# Altium project PCB_Control.V03.R00.PrjPcb (part 2 of 3)

## Sheet Amplificador.V03.R00.SchDoc: Etapa de Amplificación
size A4; SheetNumber: 8; SheetTotal: 18
Used 2 times, as channels DDS_CANAL1/Amplificador, DDS_CANAL2/Amplificador. Parts and nets are listed once, with the designators drawn on the sheet.
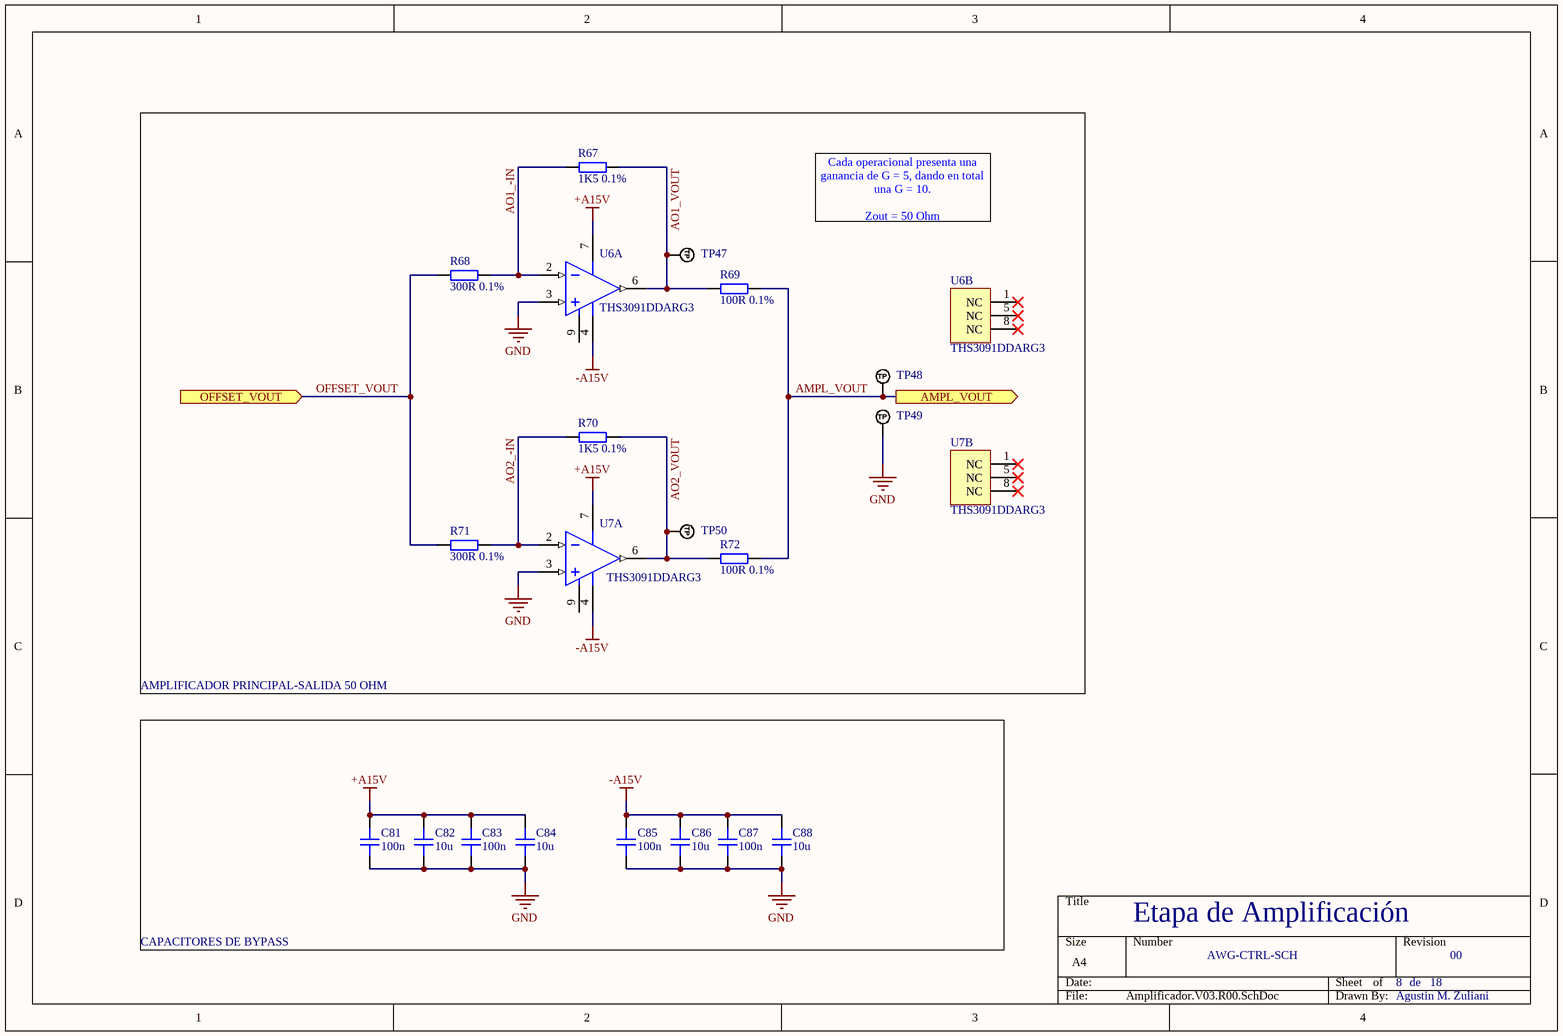
[diagram p8: Amplificador.V03.R00.SchDoc]

### Parts
C81  100n  [CAP_0805]
C82  10u  [CAP_0805]
C83  100n  [CAP_0805]
C84  10u  [CAP_0805]
C85  100n  [CAP_0805]
C86  10u  [CAP_0805]
C87  100n  [CAP_0805]
C88  10u  [CAP_0805]
R67  1K5 0.1%  [RES_0805]
R68  300R 0.1%  [RES_0805]
R69  100R 0.1%  [RES_0805]
R70  1K5 0.1%  [RES_0805]
R71  300R 0.1%  [RES_0805]
R72  100R 0.1%  [RES_0805]
TP47  TP_NOBOM  [PAD_RND_1MM]  (value not drawn)  (no BOM)
TP48  TP_NOBOM  [PAD_RND_1MM]  (value not drawn)  (no BOM)
TP49  TP_NOBOM  [PAD_RND_1MM]  (value not drawn)  (no BOM)
TP50  TP_NOBOM  [PAD_RND_1MM]  (value not drawn)  (no BOM)
U6  THS3091DDARG3  [TI-DDA8-1775X1775TP_M]  (parts A,B of 2)
U7  THS3091DDARG3  [TI-DDA8-1775X1775TP_M]  (parts A,B of 2)

### Blocks framed on the sheet
AMPLIFICADOR PRINCIPAL-SALIDA 50 OHM: R67-R72 TP47-TP50 U6 U7
CAPACITORES DE BYPASS: C81-C88

### Ports
AMPL_VOUT (out), OFFSET_VOUT (in)

### Nets
+A15V: C81.1 C82.1 C83.1 C84.1 U6.7(VS+) U7.7(VS+)
-A15V: C85.1 C86.1 C87.1 C88.1 U6.4(VS-) U7.4(VS-)
GND: C81.2 C82.2 C83.2 C84.2 C85.2 C86.2 C87.2 C88.2 TP49.1(TP) U6.3(VIN+) U7.3(VIN+)
AMPL_VOUT: R69.2 R72.2 TP48.1(TP) ; port AMPL_VOUT
AO1_-IN: R67.1 R68.2 U6.2(VIN-)
AO1_VOUT: R67.2 R69.1 TP47.1(TP) U6.6(VOUT)
AO2_-IN: R70.1 R71.2 U7.2(VIN-)
AO2_VOUT: R70.2 R72.1 TP50.1(TP) U7.6(VOUT)
OFFSET_VOUT: R68.1 R71.1 ; port OFFSET_VOUT

Not connected (* = marked no-connect by the designer): U6 1(NC)* 5(NC)* 8(NC)* 9(EP); U7 1(NC)* 5(NC)* 8(NC)* 9(EP)

### Channels
DDS_CANAL1/Amplificador: designators C81=C28 C82=C29 C83=C30 C84=C31 C85=C32 C86=C33 C87=C34 C88=C35 R67=R6#2 R68=R7#2 R69=R8#2 R70=R9#2 R71=R10#2 R72=R11#2 TP47=TP14#2 TP48=TP15#2 TP49=TP16#2 TP50=TP17#2 U6=U1#2 U7=U2#2; ports AMPL_VOUT=AMPL_VOUT OFFSET_VOUT=OFFSET_VOUT
DDS_CANAL2/Amplificador: designators C81=C36 C82=C37 C83=C38 C84=C39 C85=C40 C86=C41 C87=C42 C88=C43 R67=R12#2 R68=R13#2 R69=R14#2 R70=R15#2 R71=R16#2 R72=R17#2 TP47=TP18#2 TP48=TP19#2 TP49=TP20#2 TP50=TP21#2 U6=U3#2 U7=U4#2; ports AMPL_VOUT=AMPL_VOUT OFFSET_VOUT=OFFSET_VOUT

### Notes on the sheet
- Cada operacional presenta una ganancia de G = 5, dando en total una G = 10.
  Zout = 50 Ohm
- de

### Library data of the parts
C81-C88 = CAP_0805: Capacitor SMD 0805; Manufacturer: *; Manufacturer Part Number: *; Distributor Link: *; LCSC: *; Rating: *; Dielectric: *
R67-R72 = RES_0805: Resistor SMD 0805; Manufacturer: *; Manufacturer Part Number: *; Distributor Link: *; LCSC: *
TP47-TP50 = TEST_POINT_RND_1MM: Test Point Round 1mm (NO BOM)
U6 U7 = CMP-0018-00513-2: Single-High-Voltage, Low Distortion, Current-Feedback Operational Amplifier, 10 to 30 V, -40 to 85 degC, 8-pin SOP (DDA8), Green (RoHS & no Sb/Br); Manufacturer: Texas Instruments; Vn at Flatband(Typ)(nV/rtHz): 2; Vio(Max)(mV): 4; BW @ Acl(MHz): 235; 3rd Harmonic(dBc): 74; Iib(Max)(nA): 20000; Io(Typ)(mA): 250; Slew Rate(Typ)(V/us): 7300; @ MHz: 10; THD (Fc is 1 MHz)(Typ)(dB): -75; Diff Gain(%): 0.013; Vs(Max)(V): 30; Sub Family: High Output Current Amplifier (>=50mA), High Speed Amplifier (>=50MHz), High Supply Voltage Amplifier (>=30V); 2nd Harmonic(dBc): 66; Iq per channel(Max)(mA): 11; Diff Phase(deg): 0.02; Number of Channels: 1; Settling Time (0.1%)(Typ)(ns): 42; PartNumber: THS3091DDARG3; DatasheetVersion: SLOS423G; ComponentLink1Description: Manufacturer URL; Vs(Min)(V): 10; Code_JEDEC: MS-012; ComponentLink3Description: Package Specification; ComponentLink2Description: Datasheet; PackageReference: DDA8-1775X1775TP; ComponentLink1URL: http://www.ti.com/; PackageVersion: 4202561/F, 12/2011; PackageDescription: 8-Pin PowerPAD(TM) Plastic Small Outline, Body 4.9 x 3.9 mm, Pitch 1.27 mm; Mounting Technology: Surface Mount; ComponentLink3URL: http://www.ti.com/litv/pdf/mpds092e; Eco-Plan: Green (RoHS & no Sb/Br); Acl, min stable gain(V/V): 1; ComponentLink2URL: http://www.ti.com/general/docs/lit/getliterature.tsp?genericPartNumber=THS3091&fileType=pdf

## Sheet SY55857L.V03.R00.SchDoc: Conversor de CMOS a LVPECL
size A4; SheetNumber: 10; SheetTotal: 18
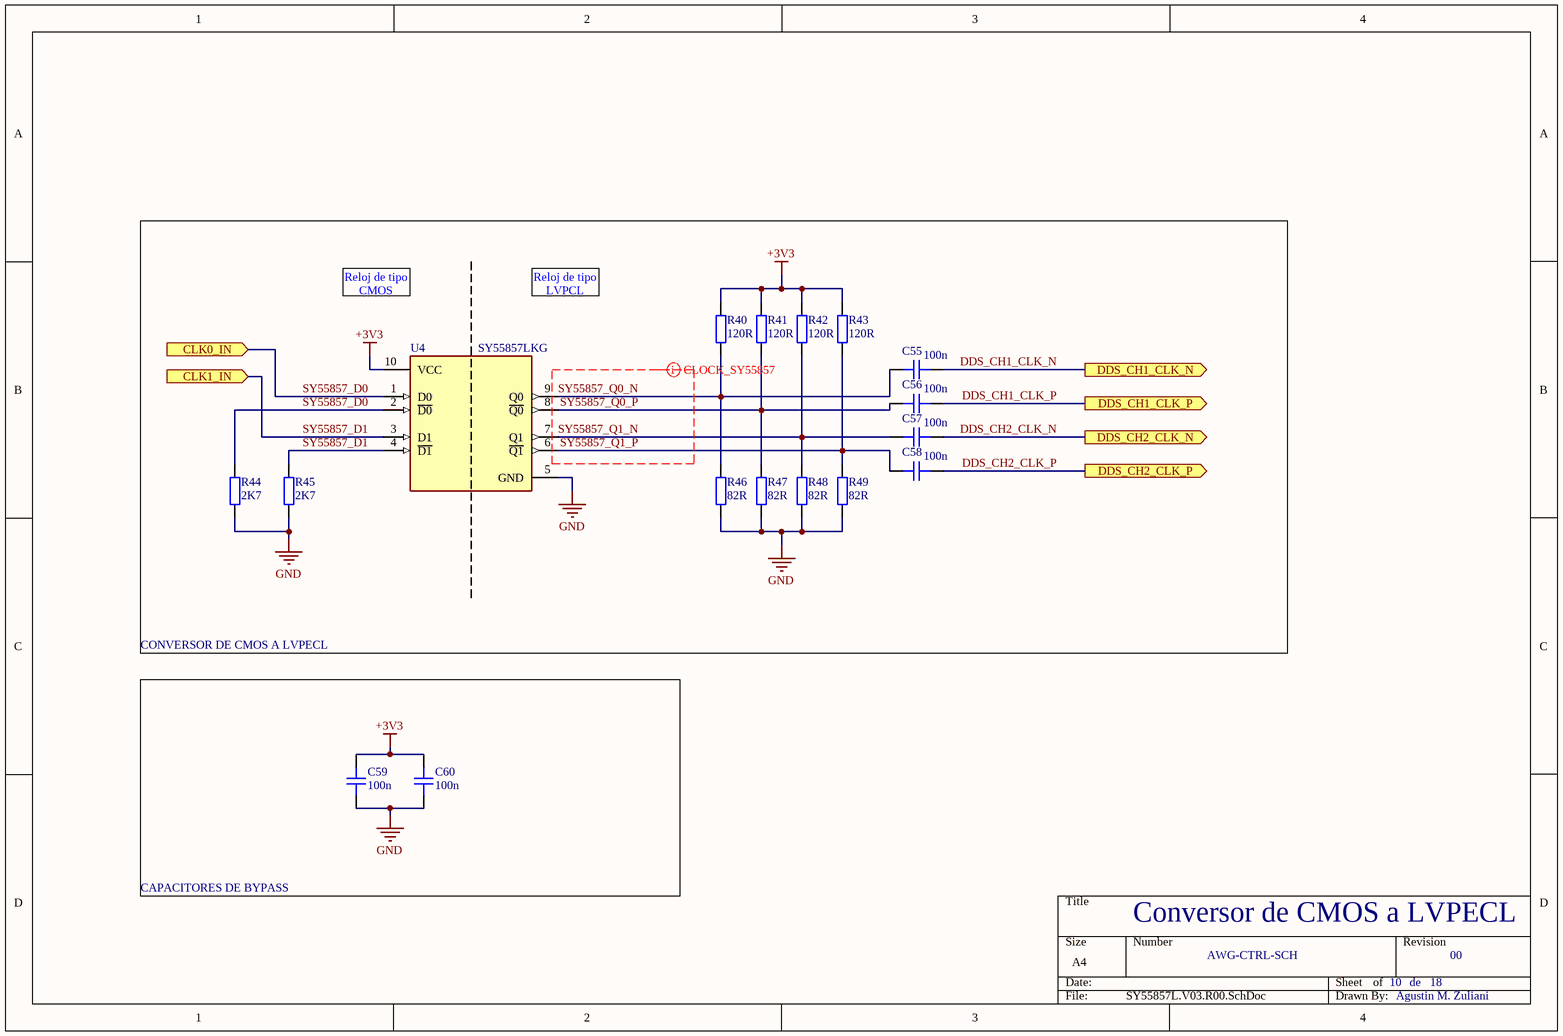
[diagram p9: SY55857L.V03.R00.SchDoc]

### Parts
(Parts that share a designator on the sheet are numbered #1, #2 ... from top to bottom, then left to right.)
C55#2  100n  [CAP_0805]
C56#1  100n  [CAP_0805]
C57#1  100n  [CAP_0805]
C58#1  100n  [CAP_0805]
C59#1  100n  [CAP_0805]
C60#1  100n  [CAP_0805]
R40  120R  [RES_0805]
R41  120R  [RES_0805]
R42  120R  [RES_0805]
R43  120R  [RES_0805]
R44  2K7  [RES_0805]
R45  2K7  [RES_0805]
R46  82R  [RES_0805]
R47  82R  [RES_0805]
R48  82R  [RES_0805]
R49  82R  [RES_0805]
U4#1  SY55857LKG  [FP-K10-1-IPC_A]

### Blocks framed on the sheet
CONVERSOR DE CMOS A LVPECL: C55#2 C56#1 C57#1 C58#1 R40-R49 U4#1
CAPACITORES DE BYPASS: C59#1 C60#1

### Ports
CLK0_IN (in), CLK1_IN (in), DDS_CH1_CLK_N (out), DDS_CH1_CLK_P (out), DDS_CH2_CLK_N (out), DDS_CH2_CLK_P (out)

### Nets
+3V3: C59#1.2 C60#1.2 R40.2 R41.2 R42.2 R43.2 U4#1.10(VCC)
GND: C59#1.1 C60#1.1 R44.2 R45.2 R46.1 R47.1 R48.1 R49.1 U4#1.5(GND)
DDS_CH1_CLK_N: C55#2.1 ; port DDS_CH1_CLK_N  [project net AD9102_CLK_N]
DDS_CH1_CLK_P: C56#1.1 ; port DDS_CH1_CLK_P  [project net AD9102_CLK_P]
DDS_CH2_CLK_N: C57#1.1 ; port DDS_CH2_CLK_N  [project net AD9102_CLK_N]
DDS_CH2_CLK_P: C58#1.1 ; port DDS_CH2_CLK_P  [project net AD9102_CLK_P]
SY55857_D0: U4#1.1(D0) ; port CLK0_IN  [project net SI5351_CLK0]
SY55857_D1: U4#1.3(D1) ; port CLK1_IN  [project net SI5351_CLK1]
SY55857_~{D0}: R44.1 U4#1.2(~{D0})
SY55857_~{D1}: R45.1 U4#1.4(~{D1})
SY55857_Q0_N: C55#2.2 R40.1 R46.2 U4#1.9(Q0)
SY55857_Q0_P: C56#1.2 R41.1 R47.2 U4#1.8(~{Q0})
SY55857_Q1_N: C57#1.2 R42.1 R48.2 U4#1.7(Q1)
SY55857_Q1_P: C58#1.2 R43.1 R49.2 U4#1.6(~{Q1})

### Layout directives
differential pair; differential pair class CLOCK_SY55857; net class CLOCK_SY55857; rule Matched Net Lengths [Tolerance = 0.25mm]: SY55857_Q0_N, SY55857_Q0_P, SY55857_Q1_N, SY55857_Q1_P

### Notes on the sheet
- Reloj de tipo CMOS
- Reloj de tipo LVPCL
- de

### Library data of the parts
C55#2 C56#1 C57#1 C58#1 C59#1 C60#1 = CAP_0805: Capacitor SMD 0805; Manufacturer: *; Manufacturer Part Number: *; Distributor Link: *; LCSC: *; Rating: *; Dielectric: *
R40-R49 = RES_0805: Resistor SMD 0805; Manufacturer: *; Manufacturer Part Number: *; Distributor Link: *; LCSC: *
U4#1 = CMP-00252-66526369-1: SY55857LKG SY55857L Series 3.3 V 2.5 Gbps ANY INPUT-to-LVPECL Dual Translator - MSOP-10; Number of Channels: 2; Min Supply Voltage: 3V; Number of Circuits: 1; Frequency: 2.5GHz; Max Supply Voltage: 3.6V; Operating Supply Voltage: 3.3V; Nominal Supply Current: 28mA; Rise Time: 200ps; Low Level Output Current: 50mA; Turn-On Delay Time: 400ps; High Level Output Current: -50mA; Channel Type: Unidirectional; Mount: Surface Mount; REACH SVHC: No SVHC; Number of Outputs: 1; Max Operating Temperature: 85°C; Height: 920µm; Termination: SMD/SMT; Number of Inputs: 1; Width: 3mm; Logic Function: Translator; Min Operating Temperature: -40°C; Ambient Temperature Range High: 85°C; Lead Free: Lead Free; Schedule B: 8542320050; Propagation Delay: 400ps; Radiation Hardening: No; Number of Pins: 10; Lifecycle Status: Production; Length: 3mm; NexarPartId: 66526369; RoHS: Compliant; Packaging: Bulk; Data Rate: 2.5Gbps; Case/Package: MSOP

## Sheet MCP4725.V03.R00.SchDoc: DAC MCP4725
size A4; SheetNumber: 11; SheetTotal: 18
Used 2 times, as channels DAC_OFFSET_CANAL1, DAC_OFFSET_CANAL2. Parts and nets are listed once, with the designators drawn on the sheet.
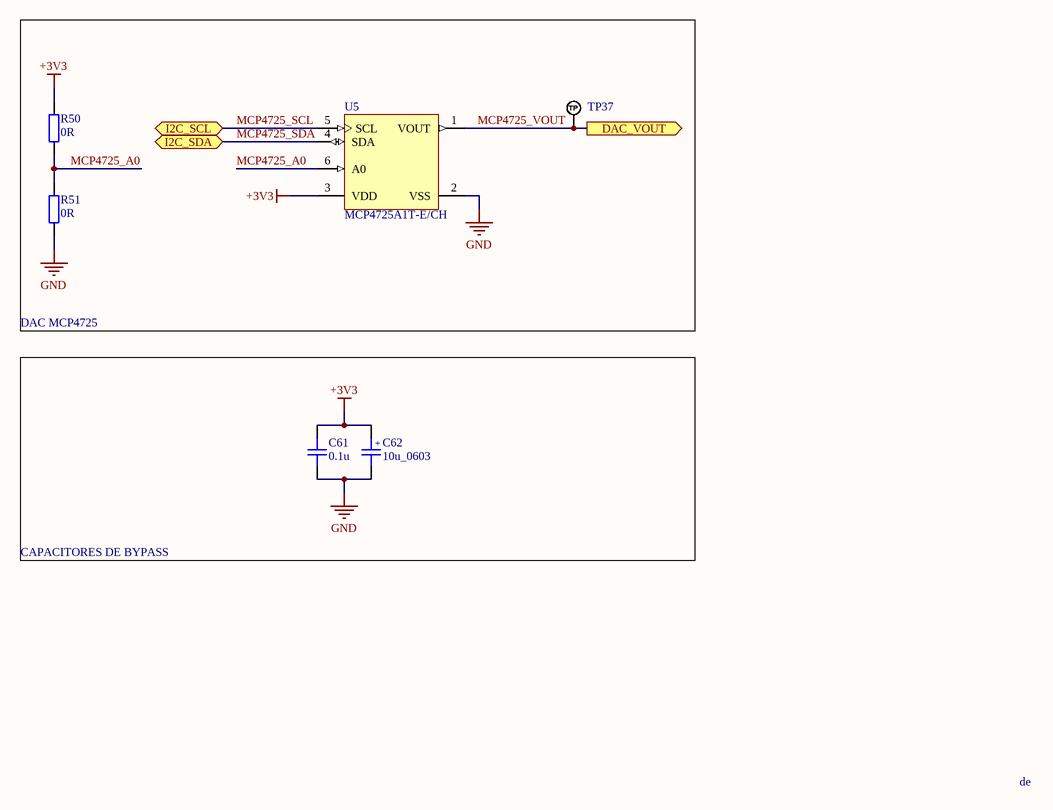
[diagram p10: MCP4725.V03.R00.SchDoc]

### Parts
C61  0.1u  [CAP_0805]
C62  10u_0603  [CAP_TANT_0603]
R50  0R  [RES_0805]
R51  0R  [RES_0805]
TP37  TP_NOBOM  [PAD_RND_1MM]  (value not drawn)  (no BOM)
U5  MCP4725A1T-E/CH  [SOT-23-CH6_N]

### Blocks framed on the sheet
DAC MCP4725: R50 R51 TP37 U5
CAPACITORES DE BYPASS: C61 C62

### Ports
DAC_VOUT (out), I2C_SCL (bidir), I2C_SDA (bidir)

### Nets
+3V3: C61.1 C62.A R50.2 U5.3(VDD)
GND: C61.2 C62.K R51.1 U5.2(VSS)
MCP4725_A0: R50.1 R51.2 U5.6(A0)
MCP4725_SCL: U5.5(SCL) ; port I2C_SCL
MCP4725_SDA: U5.4(SDA) ; port I2C_SDA
MCP4725_VOUT: TP37.1(TP) U5.1(VOUT) ; port DAC_VOUT

### Channels
DAC_OFFSET_CANAL1: designators C61=C66#1 C62=C67#1 R50=R59#1 R51=R60#1 TP37=TP50 U5=U5; ports DAC_VOUT=MCP4725_VOUT I2C_SCL=I2C_SCL I2C_SDA=I2C_SDA
DAC_OFFSET_CANAL2: designators C61=C68#2 C62=C69#2 R50=R61#2 R51=R62 TP37=TP51#1 U5=U6; ports DAC_VOUT=MCP4725_VOUT I2C_SCL=I2C_SCL I2C_SDA=I2C_SDA

### Notes on the sheet
- de
- (in symbol CAP_TANT_0603) +

### Library data of the parts
C61 = CAP_0805: Capacitor SMD 0805; Manufacturer: *; Manufacturer Part Number: *; Distributor Link: *; LCSC: *; Rating: *; Dielectric: *
C62 = CAP_TANT_0603: Capacitor SMD Tantalum 0603; Manufacturer: *; Manufacturer Part Number: *; Distributor Link: *; LCSC: *
R50 R51 = RES_0805: Resistor SMD 0805; Manufacturer: *; Manufacturer Part Number: *; Distributor Link: *; LCSC: *
TP37 = TEST_POINT_RND_1MM: Test Point Round 1mm (NO BOM)
U5 = CMP-0188-00759-2: 12-Bit Digital-to-Analog Converter with EEPROM Memory in SOT-23-6, 6-Pin SOT-23, Extended Temperature, Tape and Reel; RevisionNote: URLs added.; ComponentLink2Description: Datasheet; PackageDescription: 6-Lead Plastic Small Outline Transistor (CH) [SOT-23]; DatasheetVersion: revD, Jun-2009; ComponentLink1Description: Manufacturer URL; Code_IPC: SOT26A-6; ComponentLink3URL: http://www.microchip.com/stellent/groups/techpub_sg/documents/packagingspec/en012702.pdf; ComponentLink1URL: http://www.microchip.com/; ComponentLink3Description: Package Specification; PackageVersion: revBB, Aug-2009; ComponentLink2URL: http://ww1.microchip.com/downloads/en/DeviceDoc/22039d.pdf; PackageReference: SOT-23-CH6

## Sheet OPA41971.V03.R00.SchDoc: Conversión a DAC Bipolar
size A4; SheetNumber: 12; SheetTotal: 18
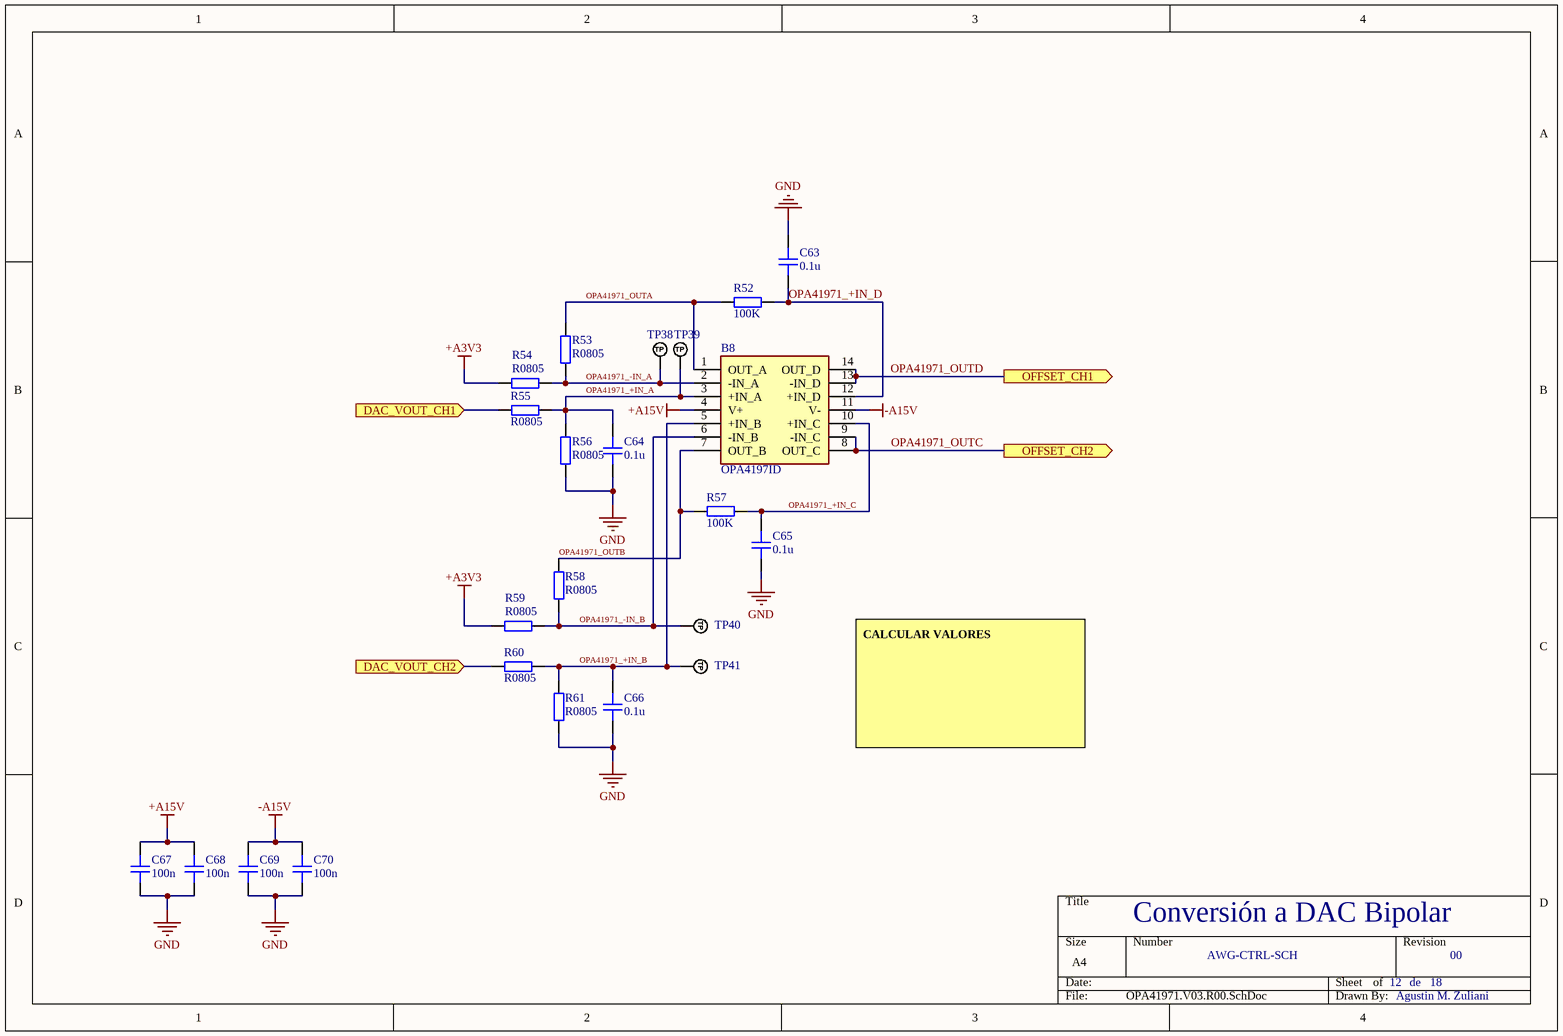
[diagram p11: OPA41971.V03.R00.SchDoc]

### Parts
(Parts that share a designator on the sheet are numbered #1, #2 ... from top to bottom, then left to right.)
B8#2  OPA4197ID  [SOIC127P600X175-14N]
C63#1  0.1u  [CAP_0805]
C64#1  0.1u  [CAP_0805]
C65#1  0.1u  [CAP_0805]
C66#2  0.1u  [CAP_0805]
C67#2  100n  [CAP_0805]
C68#1  100n  [CAP_0805]
C69#1  100n  [CAP_0805]
C70  100n  [CAP_0805]
R52#2  100K  [RES_0805]
R53#2  R0805  [RES_0805]
R54#2  R0805  [RES_0805]
R55#1  R0805  [RES_0805]
R56#1  R0805  [RES_0805]
R57#1  100K  [RES_0805]
R58#1  R0805  [RES_0805]
R59#2  R0805  [RES_0805]
R60#2  R0805  [RES_0805]
R61#1  R0805  [RES_0805]
TP38  TP_NOBOM  [PAD_RND_1MM]  (value not drawn)  (no BOM)
TP39  TP_NOBOM  [PAD_RND_1MM]  (value not drawn)  (no BOM)
TP40  TP_NOBOM  [PAD_RND_1MM]  (value not drawn)  (no BOM)
TP41  TP_NOBOM  [PAD_RND_1MM]  (value not drawn)  (no BOM)

### Ports
DAC_VOUT_CH1 (in), DAC_VOUT_CH2 (in), OFFSET_CH1 (out), OFFSET_CH2 (out)

### Nets
+A3V3: R54#2.1 R59#2.1
+A15V: B8#2.4(V+) C67#2.2 C68#1.2
-A15V: B8#2.11(V-) C69#1.2 C70.2
GND: C63#1.2 C64#1.1 C65#1.1 C66#2.1 C67#2.1 C68#1.1 C69#1.1 C70.1 R56#1.1 R61#1.1
MCP4725_VOUT: R55#1.1 ; port DAC_VOUT_CH1
MCP4725_VOUT: R60#2.1 ; port DAC_VOUT_CH2  [a separate net that carries the same name]
OPA41971_+IN_A: B8#2.3(+IN_A) C64#1.2 R55#1.2 R56#1.2 TP39.1(TP)
OPA41971_+IN_B: B8#2.5(+IN_B) C66#2.2 R60#2.2 R61#1.2 TP41.1(TP)
OPA41971_+IN_C: B8#2.10(+IN_C) C65#1.2 R57#1.2
OPA41971_+IN_D: B8#2.12(+IN_D) C63#1.1 R52#2.2
OPA41971_-IN_A: B8#2.2(-IN_A) R53#2.1 R54#2.2 TP38.1(TP)
OPA41971_-IN_B: B8#2.6(-IN_B) R58#1.1 R59#2.2 TP40.1(TP)
OPA41971_OUTA: B8#2.1(OUT_A) R52#2.1 R53#2.2
OPA41971_OUTB: B8#2.7(OUT_B) R57#1.1 R58#1.2
OPA41971_OUTC: B8#2.8(OUT_C) B8#2.9(-IN_C) ; port OFFSET_CH2  [project net DAC_DC_VIN]
OPA41971_OUTD: B8#2.13(-IN_D) B8#2.14(OUT_D) ; port OFFSET_CH1  [project net DAC_DC_VIN]

### Notes on the sheet
- CALCULAR VALORES
- de

### Library data of the parts
B8#2 = OPA4197ID: 36-V, Precision, Rail-to-Rail Input Output, Low Offset Voltage Op Amp; Manufacturer_Name: Texas Instruments; Geometry.Height: 1.75mm; Mouser Part Number: 595-OPA4197ID; Mouser Price/Stock: https://www.mouser.co.uk/ProductDetail/Texas-Instruments/OPA4197ID?qs=LuYMPh7GGMRrQsevs5FGag%3D%3D; Manufacturer_Part_Number: OPA4197ID; Datasheet Link: http://www.ti.com/lit/gpn/OPA4197
C63#1 C64#1 C65#1 C66#2 C67#2 C68#1 C69#1 C70 = CAP_0805: Capacitor SMD 0805; Manufacturer: *; Manufacturer Part Number: *; Distributor Link: *; LCSC: *; Rating: *; Dielectric: *
R52#2 R53#2 R54#2 R55#1 R56#1 R57#1 R58#1 R59#2 R60#2 R61#1 = RES_0805: Resistor SMD 0805; Manufacturer: *; Manufacturer Part Number: *; Distributor Link: *; LCSC: *
TP38-TP41 = TEST_POINT_RND_1MM: Test Point Round 1mm (NO BOM)

## Sheet BNC-OUTPUT.V03.R00.SchDoc: Salida BNC 50 Ohm
size A4; SheetNumber: 13; SheetTotal: 18
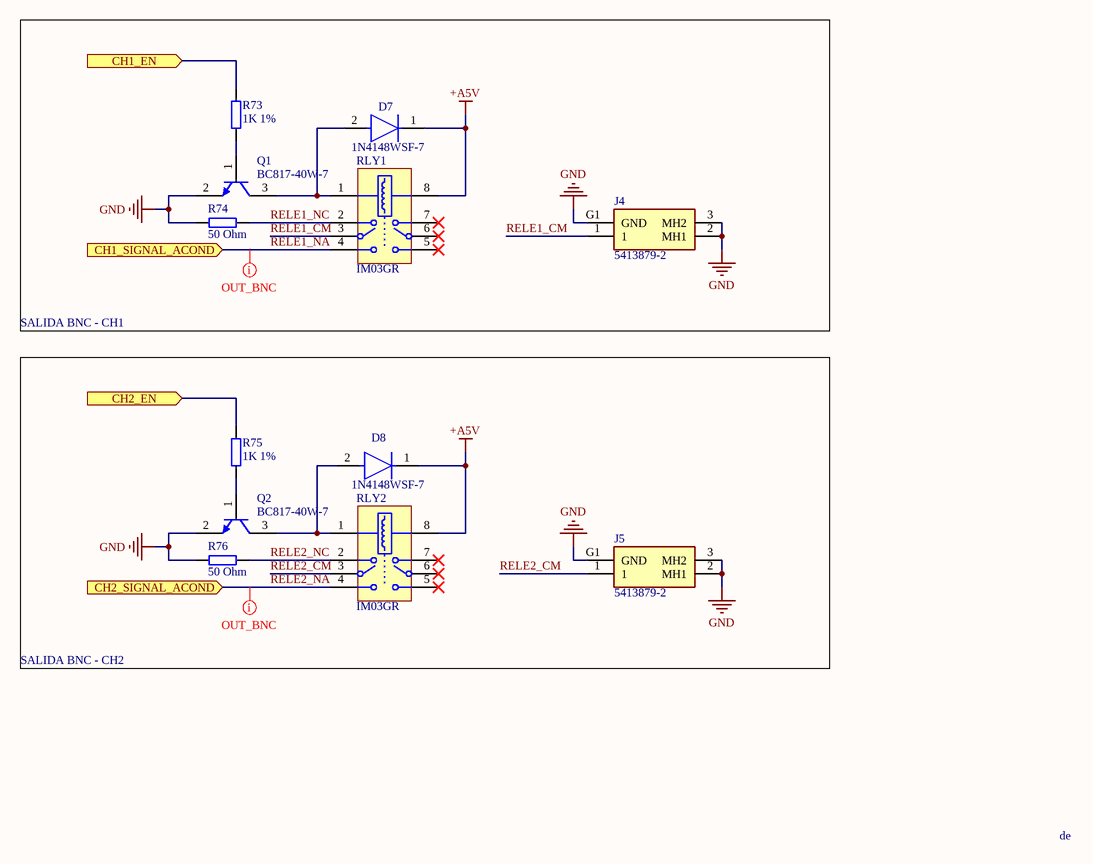
[diagram p12: BNC-OUTPUT.V03.R00.SchDoc]

### Parts
(Parts that share a designator on the sheet are numbered #1, #2 ... from top to bottom, then left to right.)
D7  1N4148WSF-7  [FP-SOD323F-MFG]
D8  1N4148WSF-7  [FP-SOD323F-MFG]
J4  5413879-2  [54138792]
J5  5413879-2  [54138792]
Q1  BC817-40W-7  [DIOD-SOT323-3_V]
Q2  BC817-40W-7  [DIOD-SOT323-3_V]
R73#2  1K 1%  [RES_0805]
R74#2  50 Ohm  [RES_0805]
R75#1  1K 1%  [RES_0805]
R76#1  50 Ohm  [RES_0805]
RLY1  IM03GR  [TECO-IM-8G-WING]
RLY2  IM03GR  [TECO-IM-8G-WING]

### Blocks framed on the sheet
SALIDA BNC - CH1: D7 J4 Q1 R73#2 R74#2 RLY1
SALIDA BNC - CH2: D8 J5 Q2 R75#1 R76#1 RLY2

### Ports
CH1_EN (in), CH1_SIGNAL_ACOND (in), CH2_EN (in), CH2_SIGNAL_ACOND (in)

### Nets
+A5V: D7.1(C) D8.1(C) RLY1.8 RLY2.8
GND: J4.2(MH1) J4.3(MH2) J4.G1(GND) J5.2(MH1) J5.3(MH2) J5.G1(GND) Q1.2(E) Q2.2(E) R74#2.1 R76#1.1
CH1_EN: R73#2.2 ; port CH1_EN
CH2_EN: R75#1.2 ; port CH2_EN
RELE1_CM: J4.1 RLY1.3
RELE1_NA: RLY1.4 ; port CH1_SIGNAL_ACOND  [project net AMPL_VOUT]
RELE1_NC: R74#2.2 RLY1.2
RELE2_CM: J5.1 RLY2.3
RELE2_NA: RLY2.4 ; port CH2_SIGNAL_ACOND  [project net AMPL_VOUT]
RELE2_NC: R76#1.2 RLY2.2
NetD7_2: D7.2(A) Q1.3(C) RLY1.1
NetD8_2: D8.2(A) Q2.3(C) RLY2.1
NetQ1_1: Q1.1(B) R73#2.1
NetQ2_1: Q2.1(B) R75#1.1

Not connected (* = marked no-connect by the designer): RLY1 5* 6* 7*; RLY2 5* 6* 7*

### Layout directives
net class OUT_BNC; rule Width Constraint [Pref Impedance = 50.00ohms    Min Impedance = 50.00ohms    Max Impedance = 50.00ohms]; rule Routing Via Style [Pref Size = 0.6mm    Pref Hole Size = 0.3mm]: AMPL_VOUT

### Notes on the sheet
- de

### Library data of the parts
D7 D8 = CMP-12791-000029-1: DIODE GEN PURP 100V 250MA SOD323; Manufacturer: Diodes Inc.; Value: 1.5pF; Max Surge Forward Current: 0.5A; Peak Reverse Current: 0.5uA; Max Junction Temp: +150°C; Height: 0.75mm; Digikey Description: DIODE GEN PURP 100V 250MA SOD323; Automotive: No; Footprint Url: https://www.diodes.com/assets/Package-Files/SOD323F.pdf; Category: Diode; Manufacturer Part Number: 1N4148WSF-7; Max Repetitive Reverse Voltage: 100V; Lead Free: Yes; Temperature Range High: +150°C; Forward Current: 250mA; Reverse Voltage: 100V; Device Class L3: Rectifier Diodes; ComponentLink2URL: https://www.diodes.com/assets/Datasheets/1N4148WSF.pdf; Package: SOD323F; RoHS: TRUE; Mouser Description: Diodes - General Purpose, Power, Switching 200mW 2pF 75Vrrm 150mA 2A 1VF; Temperature: -55°C to +150°C; Capacitance: 1.5pF; Device Class L2: Diodes; ComponentLink2Description: Datasheet; Device Class L1: Discrete Semiconductors; Octopart: https://octopart.com/1n4148wsf-7-diodes+inc.-33798544; Temperature Range Low: -55°C
J4 J5 = 5413879-2: BNC RF Interface, Jack, 50 ohm, Bayonet, 4 GHz Operating Frequency, Cable-to-Board, 1 Position, Printed Circuit Board, Board Mount / Panel Mount; Manufacturer_Name: TE Connectivity; Geometry.Height: 12.95mm; Mouser Part Number: 571-5413879-2; Mouser Price/Stock: https://www.mouser.co.uk/ProductDetail/TE-Connectivity/5413879-2?qs=dJbzCyn%252BCFbDLsMjA0NFtQ%3D%3D; Manufacturer_Part_Number: 5413879-2; Datasheet Link: https://www.te.com/commerce/DocumentDelivery/DDEController?Action=srchrtrv&DocNm=5413879&DocType=Customer%20Drawing&DocLang=English&PartCntxt=5413879-2&DocFormat=pdf
Q1 Q2 = CMP-2000-05934-1: NPN Small Signal Transistor, 45 V, 500 mA, -65 to 150 degC, 3-Pin SOT323, RoHS, Tape and Reel; Manufacturer: DiodesIncorporated; Configuration: Single; Collector- Emitter Voltage VCEO Max: 45V; Emitter- Base Voltage VEBO: 5V; DC Collector/Base Gain hfe Min: 250; Collector-Emitter Saturation Voltage: 0.7V; Collector- Base Voltage VCBO: 50V; Maximum DC Collector Current: 1A; Pd - Power Dissipation: 200mW; Gain Bandwidth Product fT: 100MHz; Unit Weight: 0.000282oz; Series: BC817; Datasheet Version: Rev. 5-2, 01/2014; Datasheet URL: http://www.diodes.com/_files/datasheets/ds30575.pdf; Manufacturer URL: http://www.diodes.com/; Length: 2.2mm; Mounting Style: SMD/SMT; Maximum Operating Temperature: +150C; Package Description: 3-Pin Small Outline Transistor, Body 2 x 1.25 mm, Pitch 0.65 mm; Width: 1.35mm; RoHS: True; Minimum Operating Temperature: -65C; Brand: DiodesIncorporated; Product Category: BipolarTransistors-BJT; Height: 1mm; Factory Pack Quantity: 3000; Package / Case: SOT-23; Packaging: Reel; Transistor Polarity: NPN; Mounting Technology: SurfaceMount; Package Reference: SOT323
R73#2 R74#2 R75#1 R76#1 = RES_0805: Resistor SMD 0805; Manufacturer: *; Manufacturer Part Number: *; Distributor Link: *; LCSC: *
RLY1 RLY2 = CMP-0439-00001-1: Low Power Consumption, High Dielectric, High Mechanical Shock Resistance, IM Relay; Manufacturer: TE Connectivity; Power Consumption: 140 mW; Contact Capacitance: 1 pF; Coil-contact Capacitance: 2 pF; Limiting Continuous Current: 2 A; ComponentLink1Description: Manufacturer URL; PackageReference: IM-8G-WING; Contact Material: PdRu +Au Covered; DatasheetVersion: Rev. 0411; ComponentLink2URL: http://www.te.com/commerce/DocumentDelivery/DDEController?Action=showdoc&DocId=Specification+Or+Standard%7F108-98001%7FS%7Fpdf%7FEnglish%7FENG_SS_108-98001_S.pdf%7F1-1462037-4; ComponentLink2Description: Datasheet; Mounting Technology: Surface Mount; Ambient Temperature: -40 to 85 degC; PartNumber: IM03GR; ComponentLink1URL: http://www.te.com/; PackageDescription: 8-Pin Relay, 10 x 6 mm Body, 0.95 mm Pitch

## Sheet Alimentacion.V03.R00.SchDoc: Alimentación y Filtros
size A4; SheetNumber: 15; SheetTotal: 18
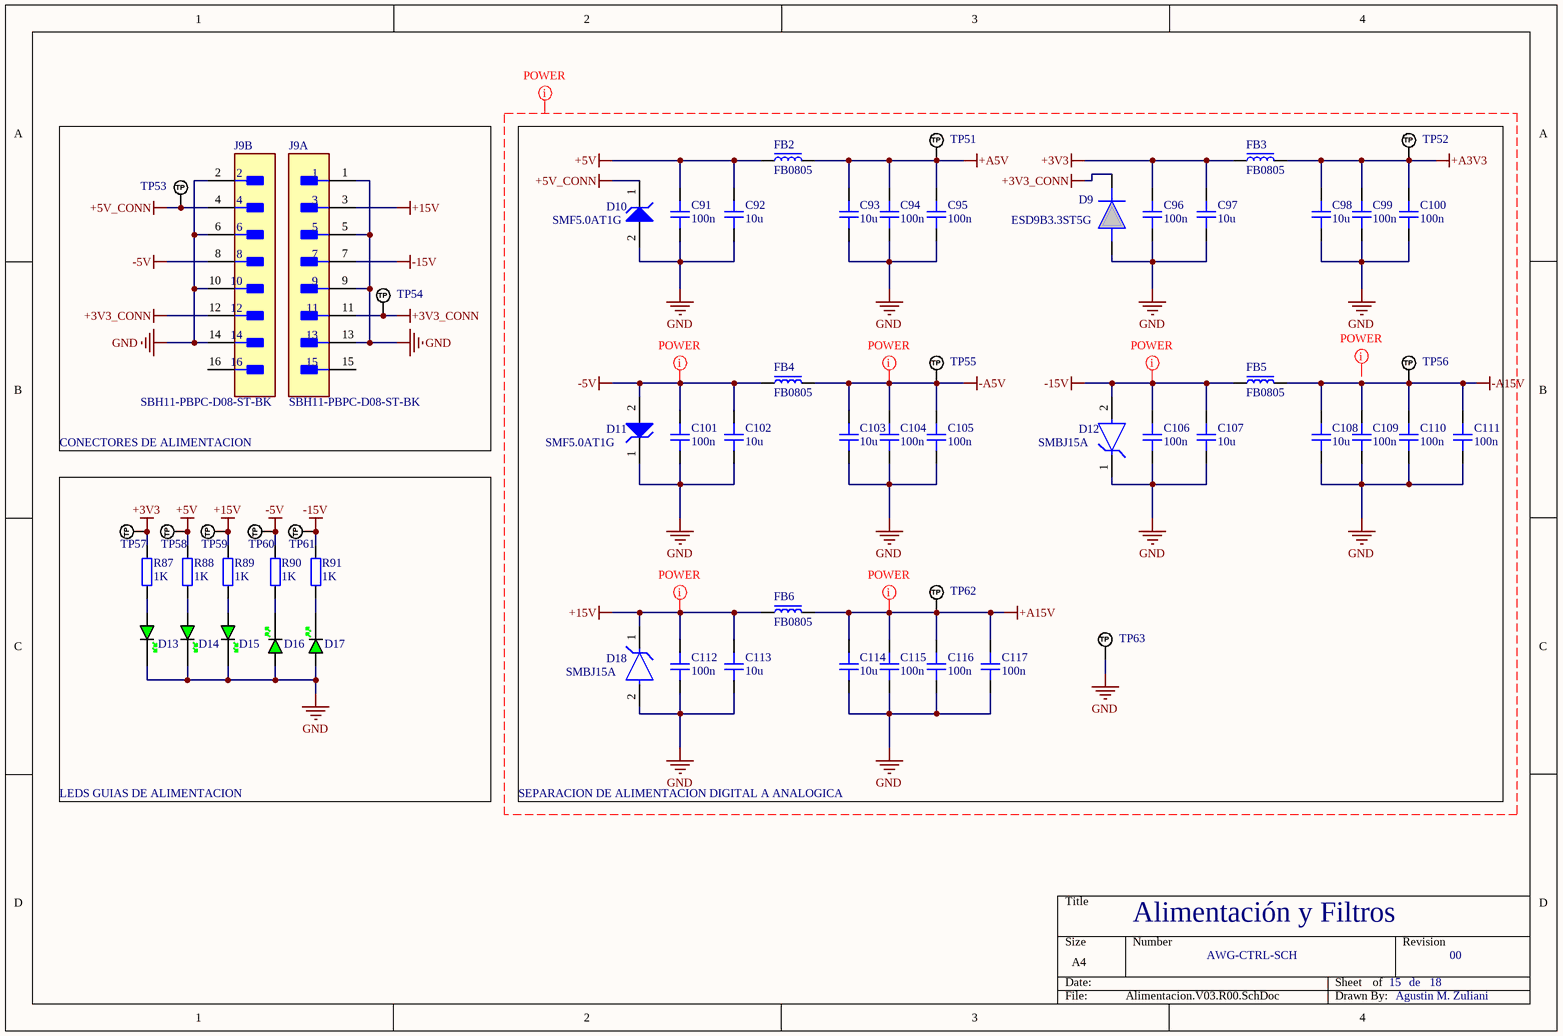
[diagram p13: Alimentacion.V03.R00.SchDoc]

### Parts
(Parts that share a designator on the sheet are numbered #1, #2 ... from top to bottom, then left to right.)
C91#2  100n  [CAP_0805]
C92#2  10u  [CAP_0805]
C93#2  10u  [CAP_0805]
C94#2  100n  [CAP_0805]
C95#2  100n  [CAP_0805]
C96#2  100n  [CAP_0805]
C97#2  10u  [CAP_0805]
C98#2  10u  [CAP_0805]
C99#2  100n  [CAP_0805]
C100#2  100n  [CAP_0805]
C101#2  100n  [CAP_0805]
C102#2  10u  [CAP_0805]
C103#2  10u  [CAP_0805]
C104#2  100n  [CAP_0805]
C105#2  100n  [CAP_0805]
C106#2  100n  [CAP_0805]
C107  10u  [CAP_0805]
C108  10u  [CAP_0805]
C109  100n  [CAP_0805]
C110  100n  [CAP_0805]
C111  100n  [CAP_0805]
C112  100n  [CAP_0805]
C113  10u  [CAP_0805]
C114  10u  [CAP_0805]
C115#2  100n  [CAP_0805]
C116#2  100n  [CAP_0805]
C117#2  100n  [CAP_0805]
D9  ESD9B3.3ST5G  [SODFL1006X40N]
D10  SMF5.0AT1G  [ONSC-SOD-123FL-2-498_V]
D11  SMF5.0AT1G  [ONSC-SOD-123FL-2-498_V]
D12  SMBJ15A  [FP-SMBJ-MFG]
D13  GREEN  [LED_0805_GREEN]  (value not drawn)
D14  GREEN  [LED_0805_GREEN]  (value not drawn)
D15  GREEN  [LED_0805_GREEN]  (value not drawn)
D16  GREEN  [LED_0805_GREEN]  (value not drawn)
D17  GREEN  [LED_0805_GREEN]  (value not drawn)
D18  SMBJ15A  [FP-SMBJ-MFG]
FB2  FB0805  [FB_0805]
FB3  FB0805  [FB_0805]
FB4  FB0805  [FB_0805]
FB5  FB0805  [FB_0805]
FB6  FB0805  [FB_0805]
J9  SBH11-PBPC-D08-ST-BK  [FP-SBH11-PBPC-D08-ST-BK-MFG]  (parts A,B of 2)
R87  1K  [RES_0805]
R88  1K  [RES_0805]
R89  1K  [RES_0805]
R90#2  1K  [RES_0805]
R91#2  1K  [RES_0805]
TP51#2  TP_NOBOM  [PAD_RND_1MM]  (value not drawn)  (no BOM)
TP52  TP_NOBOM  [PAD_RND_1MM]  (value not drawn)  (no BOM)
TP53  TP_NOBOM  [PAD_RND_1MM]  (value not drawn)  (no BOM)
TP54  TP_NOBOM  [PAD_RND_1MM]  (value not drawn)  (no BOM)
TP55  TP_NOBOM  [PAD_RND_1MM]  (value not drawn)  (no BOM)
TP56  TP_NOBOM  [PAD_RND_1MM]  (value not drawn)  (no BOM)
TP57  TP_NOBOM  [PAD_RND_1MM]  (value not drawn)  (no BOM)
TP58  TP_NOBOM  [PAD_RND_1MM]  (value not drawn)  (no BOM)
TP59#2  TP_NOBOM  [PAD_RND_1MM]  (value not drawn)  (no BOM)
TP60#2  TP_NOBOM  [PAD_RND_1MM]  (value not drawn)  (no BOM)
TP61#2  TP_NOBOM  [PAD_RND_1MM]  (value not drawn)  (no BOM)
TP62#2  TP_NOBOM  [PAD_RND_1MM]  (value not drawn)  (no BOM)
TP63#2  TP_NOBOM  [PAD_RND_1MM]  (value not drawn)  (no BOM)

### Blocks framed on the sheet
CONECTORES DE ALIMENTACION: J9 TP53 TP54
SEPARACION DE ALIMENTACION DIGITAL A ANALOGICA: C91#2 C92#2 C93#2 C94#2 C95#2 C96#2 C97#2 C98#2 C99#2 C100#2 C101#2 C102#2 C103#2 C104#2 C105#2 C106#2 C107-C114 C115#2 C116#2 C117#2 D9-D12 D18 FB2-FB6 TP51#2 TP52 TP55 TP56 TP62#2 TP63#2
LEDS GUIAS DE ALIMENTACION: D13-D17 R87-R89 R90#2 R91#2 TP57 TP58 TP59#2 TP60#2 TP61#2

### Nets
+3V3: C96#2.1 C97#2.1 FB3.1 R87.2 TP57.1(TP)
+3V3_CONN: D9.1(K) J9.11 J9.12 TP54.1(TP)
+5V: C91#2.1 C92#2.1 FB2.1 R88.2 TP58.1(TP)
+5V_CONN: D10.1(K) J9.4 TP53.1(TP)
+15V: C112.1 C113.1 D18.1(C) FB6.1 J9.3 R89.2 TP59#2.1(TP)
+A3V3: C98#2.1 C99#2.1 C100#2.1 FB3.2 TP52.1(TP)
+A5V: C93#2.1 C94#2.1 C95#2.1 FB2.2 TP51#2.1(TP)
+A15V: C114.1 C115#2.1 C116#2.1 C117#2.1 FB6.2 TP62#2.1(TP)
-5V: C101#2.1 C102#2.1 D11.2(A) FB4.1 J9.8 R90#2.2 TP60#2.1(TP)
-15V: C106#2.1 C107.1 D12.2(A) FB5.1 J9.7 R91#2.2 TP61#2.1(TP)
-A5V: C103#2.1 C104#2.1 C105#2.1 FB4.2 TP55.1(TP)
-A15V: C108.1 C109.1 C110.1 C111.1 FB5.2 TP56.1(TP)
GND: C91#2.2 C92#2.2 C93#2.2 C94#2.2 C95#2.2 C96#2.2 C97#2.2 C98#2.2 C99#2.2 C100#2.2 C101#2.2 C102#2.2 C103#2.2 C104#2.2 C105#2.2 C106#2.2 C107.2 C108.2 C109.2 C110.2 C111.2 C112.2 C113.2 C114.2 C115#2.2 C116#2.2 C117#2.2 D9.2(A) D10.2(A) D11.1(K) D12.1(C) D13.K D14.K D15.K D16.A D17.A D18.2(A) J9.1 J9.2 J9.5 J9.6 J9.9 J9.10 J9.13 J9.14 TP63#2.1(TP)
NetD13_A: D13.A R87.1
NetD14_A: D14.A R88.1
NetD15_A: D15.A R89.1
NetD16_K: D16.K R90#2.1
NetD17_K: D17.K R91#2.1

Not connected (* = marked no-connect by the designer): J9 15 16

### Layout directives
net class Power; rule Width Constraint [Pref Width = 0.5mm    Min Width = 0.2mm    Max Width = 1mm]: +3V3, +3V3_CONN, +5V, +5V_CONN, +15V, +A3V3, +A5V, +A15V, -5V, -15V, -A5V, -A15V, GND
net class POWER; rule Width Constraint [Pref Width = 0.5mm    Min Width = 0.2mm    Max Width = 1mm]; rule Routing Via Style [Pref Size = 1.27mm    Pref Hole Size = 0.711mm]; rule Clearance Constraint [Clearance = 0.2mm]; rule Polygon Connect Style [Style - Direct Connect]: +3V3, +3V3_CONN, +5V, +5V_CONN, +15V, +A3V3, +A5V, +A15V, -5V, -15V, -A5V, -A15V, GND

### Notes on the sheet
- de

### Library data of the parts
C91#2 C92#2 C93#2 C94#2 C95#2 C96#2 C97#2 C98#2 C99#2 C100#2 C101#2 C102#2 C103#2 C104#2 C105#2 C106#2 C107-C114 C115#2 C116#2 C117#2 = CAP_0805: Capacitor SMD 0805; Manufacturer: *; Manufacturer Part Number: *; Distributor Link: *; LCSC: *; Rating: *; Dielectric: *
D9 = ESD9B3.3ST5G: SZ Prefix for Automotive and Other Applications Requiring Unique Site and Control Change Requirements ; AECQ101 Qualified and PPAP Capable ; This is a PbFree Device; Low Capacitance 15 pF; Low Clamping Voltage; Small Body Outline Dimensions: 0.039 x 0.024 (1.0mm x 0.60mm); Low Body Height: 0.016 (0.4 mm); Response Time is < 1 ns; IEC6100042 Level 4 ESD Protection; Low Leakage; Manufacturer_Name: onsemi; Geometry.Height: 0.4mm; Mouser Part Number: 863-ESD9B3.3ST5G; Mouser Price/Stock: https://www.mouser.co.uk/ProductDetail/onsemi/ESD9B3.3ST5G?qs=yU2N9dt%252BrfmXrPf3vhgUEA%3D%3D; Manufacturer_Part_Number: ESD9B3.3ST5G; Datasheet Link: https://www.onsemi.com/pub/Collateral/ESD9B-D.PDF
D10 D11 = CMP-1061-00612-1: 200 W Transient Voltage Suppressor, 2-Pin SOD-123FL, Pb-Free, Tape and Reel; Manufacturer: On Semiconductor; Direction: Unidirectional; IR Max (uA): 400; V(BR) Typ (V): 6.7; PackageDescription: 2-Pin SOD, Body 1.65 x 2.7 mm; PartNumber: SMF5.0AT1G; ComponentLink3Description: Package Specification; ComponentLink3URL: http://www.onsemi.com/pub_link/Collateral/498-01.PDF; PackageVersion: Rev. D, 05/2013; Mounting Technology: Surface Mount; PackageReference: SOD-123FL-2-498; ComponentLink2URL: http://www.onsemi.com/pub_link/Collateral/SMF5.0AT1-D.PDF; DatasheetVersion: Rev. 7; ComponentLink1Description: Manufacturer URL; Packing: Tape and Reel; RoHS: Pb-Free; ComponentLink1URL: http://www.onsemi.com/; ComponentLink2Description: Datasheet
D12 D18 = CMP-07401-000033-1: TVS DIODE 15VWM 24.4VC SMB; Max Breakdown Voltage: 19.2V; Reverse Standoff Voltage: 15V; Number of Elements: 1; Diode Type: ZENER; Max Reverse Leakage Current: 5uA; Operating Supply Voltage: 3.5V; Element Configuration: Single; Reverse Breakdown Voltage: 16.7V; Peak Pulse Power: 600W; Peak Pulse Current: 24A; Polarity: Unidirectional; Clamping Voltage: 24.4V; ESD Protection: Yes; Test Current: 1mA; Power Line Protection: No; Max Surge Current: 100A; Min Operating Temperature: -55°C; Number of Pins: 2; Case/Package: DO-214AA; Number of Channels: 1; Series: SMBJ; Height: 2.42mm; Resistor Type: Zener; Max Power Dissipation: 600W; REACH SVHC: No SVHC; Package Quantity: 1; Breakdown Voltage: 19.2V; Radiation Hardening: No; Direction: Unidirectional; Number of Unidirectional Channels: 1; Termination: SMD/SMT; Length: 4.57mm; Width: 3.94mm; Packaging: Tape and Reel; Leakage Current: 5uA; RoHS Compliant: Yes; Mount: Surface Mount; Min Breakdown Voltage: 16.7V; Max Operating Temperature: 150°C
D13-D17 = LED_0805_GREEN: LED 0805 GREEN SMD; Manufacturer: *; Manufacturer Part Number: *; Distributor Link: *; LCSC: *
FB2-FB6 = FB_0805: Ferrite Bead SMD 0805; Manufacturer: *; Manufacturer Part Number: *; Distributor Link: *; LCSC: *
J9 = CMP-25680-000019-1: CONN HEADER VERT 16POS 2.54MM; Manufacturer: Sullins; Current Rating: 3A; Conn Gender: Male; Conn Orientation: Straight; Standoff Height: 0.3mm; Number Of Contacts: 16; Temperature: -40°C to +105°C; Digikey Description: CONN HEADER VERT 16POS 2.54MM; Contact Material: Gold,Nickel; Temperature Range High: +105°C; Package: 0; Octopart: https://octopart.com/sbh11-pbpc-d08-st-bk-sullins-12270491; Category: Conn; Automotive: No; Lead Free: Yes; ComponentLink2Description: Datasheet; Device Class L1: Connectors; Number Of Rows: 2; ComponentLink2URL: https://drawings-pdf.s3.amazonaws.com/11091.pdf; RoHS: TRUE; Height: 9.3mm; Pitch: 2.54mm; Temperature Range Low: -40°C; Device Class L2: Headers and Wire Housings; Manufacturer Part Number: SBH11-PBPC-D08-ST-BK; Device Class L3: unset
R87-R89 R90#2 R91#2 = RES_0805: Resistor SMD 0805; Manufacturer: *; Manufacturer Part Number: *; Distributor Link: *; LCSC: *
TP51#2 TP52-TP58 TP59#2 TP60#2 TP61#2 TP62#2 TP63#2 = TEST_POINT_RND_1MM: Test Point Round 1mm (NO BOM)

## Sheet ConexionesPanelFrontal.V03.R00.SchDoc: Comunicación con Panel Frontal
size A4; SheetNumber: 14; SheetTotal: 18
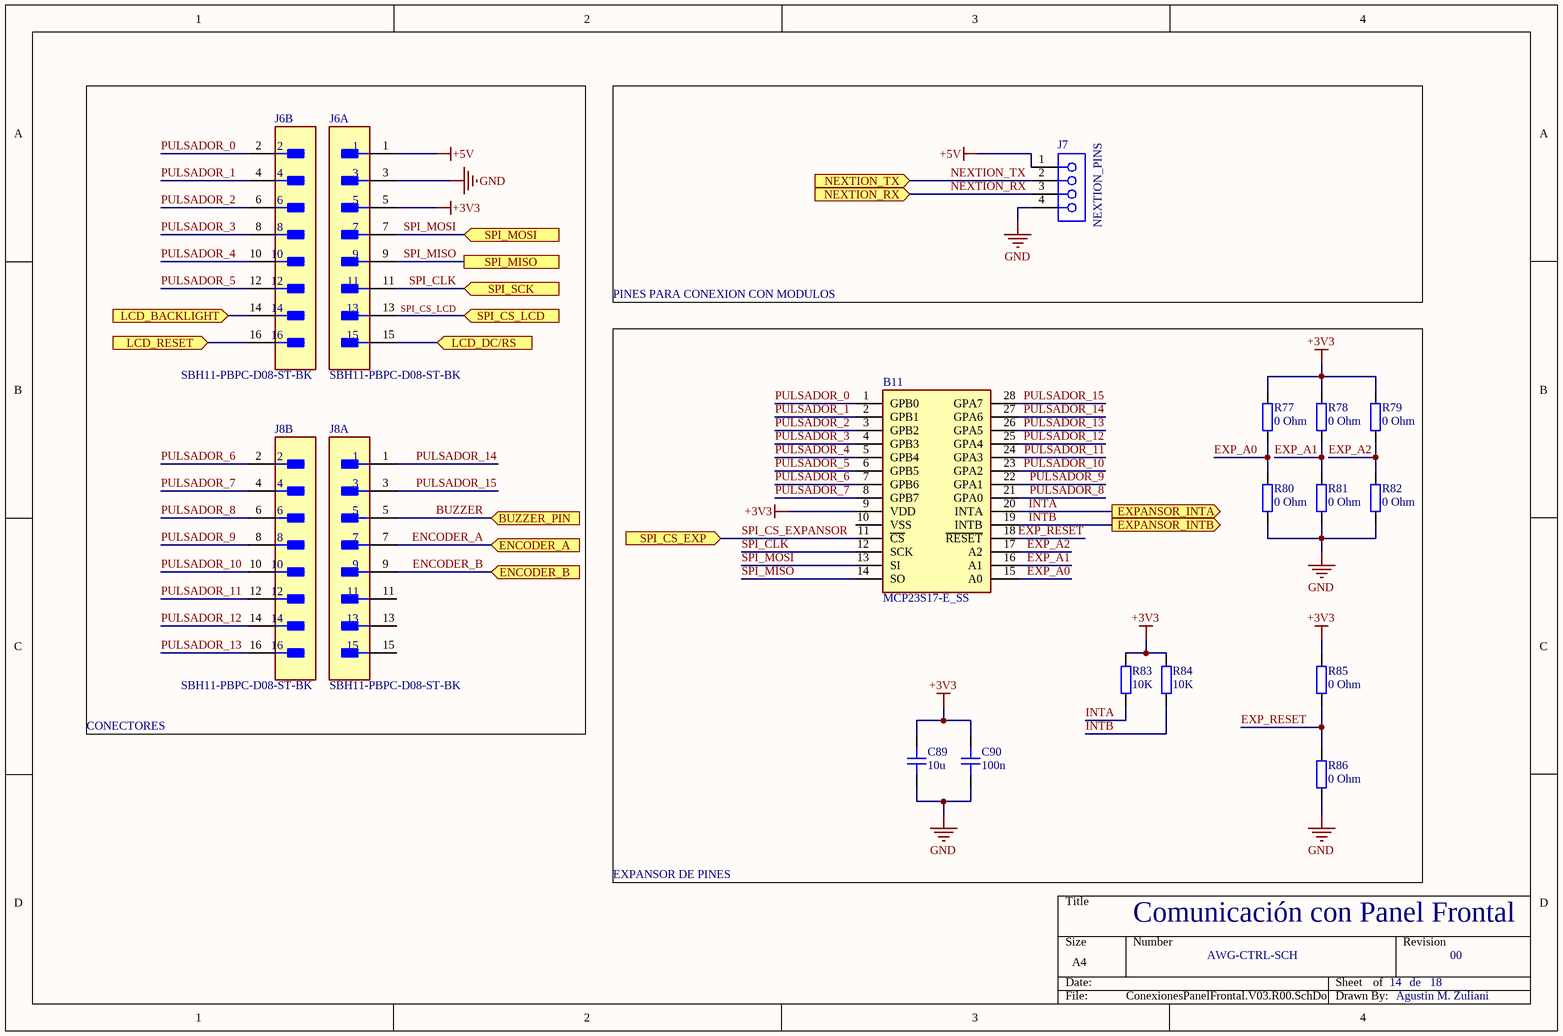
[diagram p14: ConexionesPanelFrontal.V03.R00.SchDoc]

### Parts
(Parts that share a designator on the sheet are numbered #1, #2 ... from top to bottom, then left to right.)
B11#2  MCP23S17-E_SS  [SOP65P780X200-28N]
C89#2  10u  [CAP_0805]
C90#2  100n  [CAP_0805]
J6  SBH11-PBPC-D08-ST-BK  [FP-SBH11-PBPC-D08-ST-BK-MFG]  (parts A,B of 2)
J7  NEXTION_PINS  [SMTC-SLW-104-01-X-S]
J8  SBH11-PBPC-D08-ST-BK  [FP-SBH11-PBPC-D08-ST-BK-MFG]  (parts A,B of 2)
R77#2  0 Ohm  [RES_0805]
R78#2  0 Ohm  [RES_0805]
R79#2  0 Ohm  [RES_0805]
R80  0 Ohm  [RES_0805]
R81  0 Ohm  [RES_0805]
R82  0 Ohm  [RES_0805]
R83  10K  [RES_0805]
R84  10K  [RES_0805]
R85  0 Ohm  [RES_0805]
R86  0 Ohm  [RES_0805]

### Blocks framed on the sheet
CONECTORES: J6 J8
PINES PARA CONEXION CON MODULOS: J7
EXPANSOR DE PINES: B11#2 C89#2 C90#2 R77#2 R78#2 R79#2 R80-R86

### Ports
BUZZER_PIN (in), ENCODER_A (in), ENCODER_B (in), EXPANSOR_INTA (out), EXPANSOR_INTB (out), LCD_BACKLIGHT (in), LCD_DC/RS (in), LCD_RESET (in), NEXTION_RX (in), NEXTION_TX (in), SPI_CS_EXP (in), SPI_CS_LCD (in), SPI_MISO, SPI_MOSI (in), SPI_SCK (in)

### Nets
+3V3: B11#2.9(VDD) C89#2.2 C90#2.2 J6.5 R77#2.2 R78#2.2 R79#2.2 R83.2 R84.2 R85.2
+5V: J6.1 J7.1
GND: C89#2.1 C90#2.1 J6.3 J7.4 R80.1 R81.1 R82.1 R86.1
BUZZER: J8.5 ; port BUZZER_PIN
ENCODER_A: J8.7 ; port ENCODER_A
ENCODER_B: J8.9 ; port ENCODER_B
EXP_A0: B11#2.15(A0) R77#2.1 R80.2
EXP_A1: B11#2.16(A1) R78#2.1 R81.2
EXP_A2: B11#2.17(A2) R79#2.1 R82.2
EXP_RESET: B11#2.18(~{RESET}) R85.1 R86.2
INTA: B11#2.20(INTA) R83.1 ; port EXPANSOR_INTA
INTB: B11#2.19(INTB) R84.1 ; port EXPANSOR_INTB
LCD_RESET: J6.16 ; port LCD_RESET
MCU_GPIO27: J6.14 ; port LCD_BACKLIGHT
MCU_GPIO28: J6.15 ; port LCD_DC/RS
NEXTION_RX: J7.3 ; port NEXTION_RX
NEXTION_TX: J7.2 ; port NEXTION_TX
PULSADOR_0: B11#2.1(GPB0) J6.2
PULSADOR_1: B11#2.2(GPB1) J6.4
PULSADOR_2: B11#2.3(GPB2) J6.6
PULSADOR_3: B11#2.4(GPB3) J6.8
PULSADOR_4: B11#2.5(GPB4) J6.10
PULSADOR_5: B11#2.6(GPB5) J6.12
PULSADOR_6: B11#2.7(GPB6) J8.2
PULSADOR_7: B11#2.8(GPB7) J8.4
PULSADOR_8: B11#2.21(GPA0) J8.6
PULSADOR_9: B11#2.22(GPA1) J8.8
PULSADOR_10: B11#2.23(GPA2) J8.10
PULSADOR_11: B11#2.24(GPA3) J8.12
PULSADOR_12: B11#2.25(GPA4) J8.14
PULSADOR_13: B11#2.26(GPA5) J8.16
PULSADOR_14: B11#2.27(GPA6) J8.1
PULSADOR_15: B11#2.28(GPA7) J8.3
SPI_CLK: B11#2.12(SCK) J6.11 ; port SPI_SCK
SPI_CS_EXPANSOR: B11#2.11(~{CS}) ; port SPI_CS_EXP  [project net MCU_GPIO18]
SPI_CS_LCD: J6.13 ; port SPI_CS_LCD  [project net MCU_GPIO17]
SPI_MISO: B11#2.14(SO) J6.9 ; port SPI_MISO
SPI_MOSI: B11#2.13(SI) J6.7 ; port SPI_MOSI

Not connected (* = marked no-connect by the designer): B11#2 10(VSS); J8 11 13 15

### Notes on the sheet
- de

### Library data of the parts
B11#2 = MCP23S17-E_SS: I/O Port Expander 16-Bit SPI SSOP28; Manufacturer_Name: Microchip; Manufacturer_Part_Number: MCP23S17-E/SS; Geometry.Height: 2mm; Mouser Part Number: 579-MCP23S17-E/SS; Mouser Price/Stock: https://www.mouser.co.uk/ProductDetail/Microchip-Technology/MCP23S17-E-SS?qs=usxtMOJb1RweSOLq2FO9lA%3D%3D; Datasheet Link: https://datasheet.datasheetarchive.com/originals/distributors/SFDatasheet-4/sf-00090057.pdf
C89#2 C90#2 = CAP_0805: Capacitor SMD 0805; Manufacturer: *; Manufacturer Part Number: *; Distributor Link: *; LCSC: *; Rating: *; Dielectric: *
J6 J8 = CMP-25680-000019-1: as J9 on sheet Alimentacion.V03.R00; Temperature: -40°C to +105°C; Digikey Description: CONN HEADER VERT 16POS 2.54MM; Contact Material: Gold,Nickel; Temperature Range High: +105°C; Package: 0; Octopart: https://octopart.com/sbh11-pbpc-d08-st-bk-sullins-12270491; Category: Conn; Automotive: No; Lead Free: Yes; ComponentLink2Description: Datasheet; Device Class L1: Connectors; Number Of Rows: 2; ComponentLink2URL: https://drawings-pdf.s3.amazonaws.com/11091.pdf; RoHS: TRUE; Height: 9.3mm; Pitch: 2.54mm; Temperature Range Low: -40°C; Device Class L2: Headers and Wire Housings; Manufacturer Part Number: SBH11-PBPC-D08-ST-BK; Device Class L3: unset
J7 = CMP-1023-00133-1: Low Profile Socket Strips, Through-hole, Vertical, -55 to 125 degC, 2.54 mm Pitch, 4-Pin, Female, RoHS; PartNumber: SLW-104-01-L-S; Manufacturer: Samtec; Pitch: 2.54 mm; Orientation: Vertical; ComponentLink1Description: Manufacturer URL; ComponentLink3Description: Package Specification; ComponentLink2URL: http://www.samtec.com/documents/webfiles/pdf/SLW.PDF; RoHS: True; ComponentLink2Description: Datasheet; ComponentLink3URL: http://www.samtec.com/documents/webfiles/cpdf/SLW-1XX-01-X-X-MKT.pdf; ComponentLink1URL: http://www.samtec.com; PackageVersion: X, 9/1987; PackageDescription: Low Profile Socket Strip; PackageReference: SLW-104-01-X-S; Mounting Technology: Through-hole; Temperature Range: -55 to 125 degC; DatasheetVersion: F-214
R77#2 R78#2 R79#2 R80-R86 = RES_0805: Resistor SMD 0805; Manufacturer: *; Manufacturer Part Number: *; Distributor Link: *; LCSC: *

## Sheet ReferenciaTensionDDS.V03.R00.SchDoc: Ajuste de Amplitud para DDS
size A4; SheetNumber: 16; SheetTotal: 18
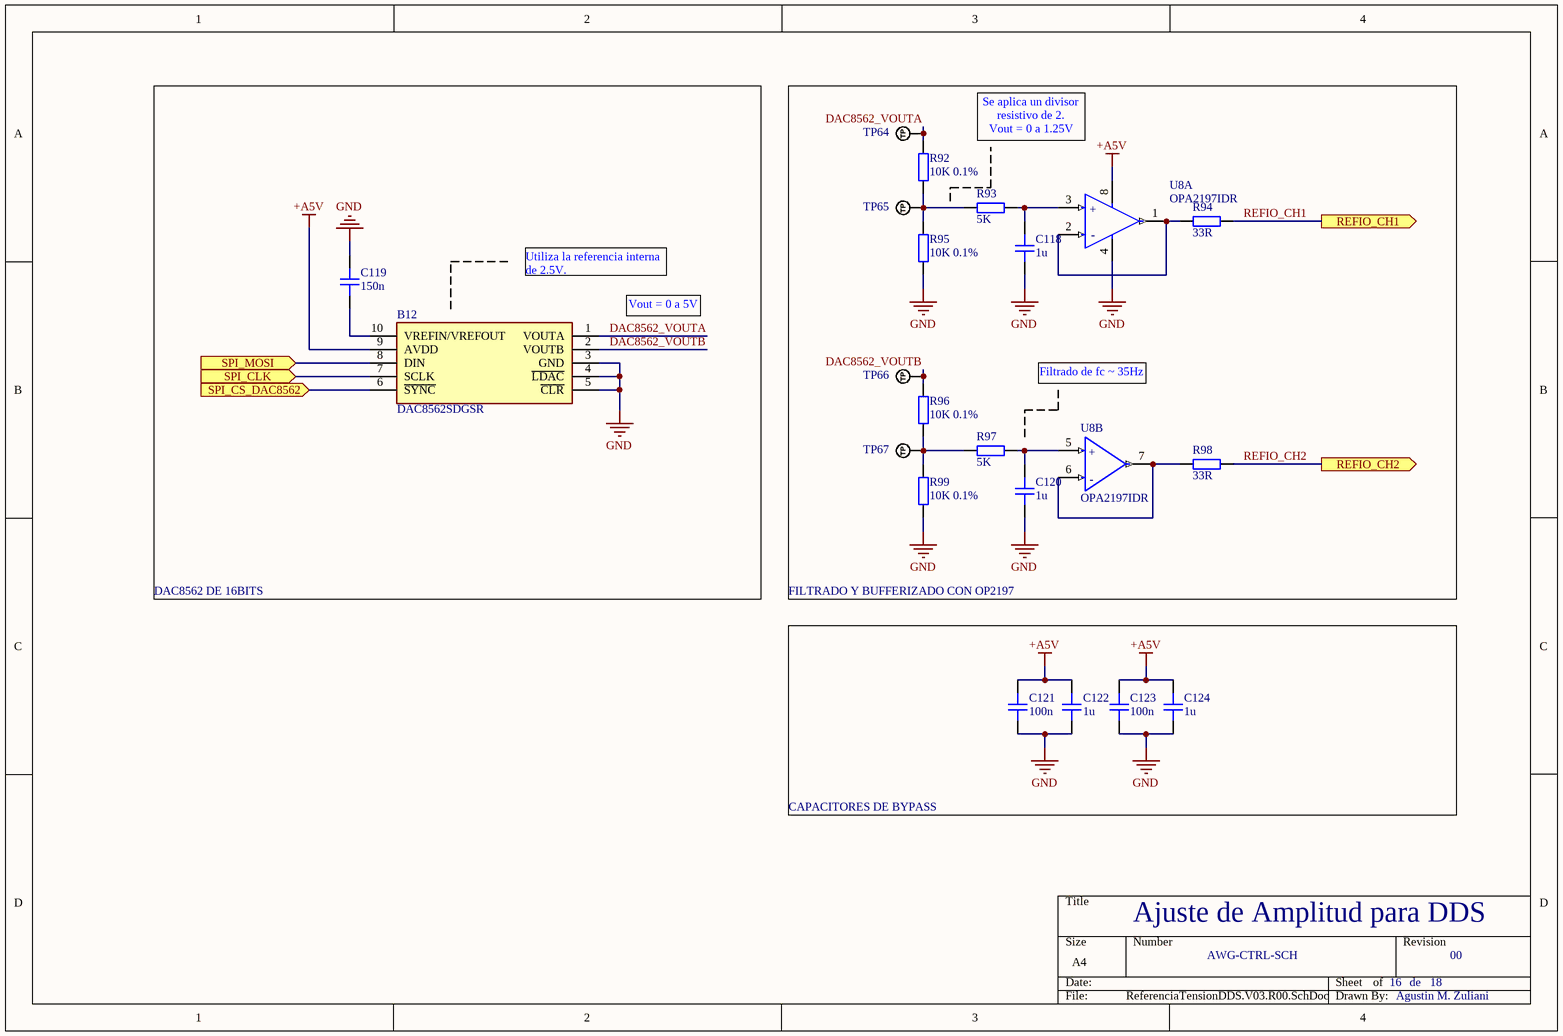
[diagram p15: ReferenciaTensionDDS.V03.R00.SchDoc]

### Parts
(Parts that share a designator on the sheet are numbered #1, #2 ... from top to bottom, then left to right.)
B12  DAC8562SDGSR  [SOP50P490X110-10N]
C118#2  1u  [CAP_0805]
C119#2  150n  [CAP_0805]
C120#2  1u  [CAP_0805]
C121#2  100n  [CAP_0805]
C122#2  1u  [CAP_0805]
C123#2  100n  [CAP_0805]
C124#2  1u  [CAP_0805]
R92#2  10K 0.1%  [RES_0805]
R93#2  5K  [RES_0805]
R94#2  33R  [RES_0805]
R95#2  10K 0.1%  [RES_0805]
R96#2  10K 0.1%  [RES_0805]
R97#2  5K  [RES_0805]
R98#2  33R  [RES_0805]
R99#2  10K 0.1%  [RES_0805]
TP64#2  TP_NOBOM  [PAD_RND_1MM]  (value not drawn)  (no BOM)
TP65#2  TP_NOBOM  [PAD_RND_1MM]  (value not drawn)  (no BOM)
TP66#2  TP_NOBOM  [PAD_RND_1MM]  (value not drawn)  (no BOM)
TP67#2  TP_NOBOM  [PAD_RND_1MM]  (value not drawn)  (no BOM)
U8  OPA2197IDR  [FP-D0008A-MFG]  (parts A,B of 2)

### Blocks framed on the sheet
DAC8562 DE 16BITS: B12 C119#2
FILTRADO Y BUFFERIZADO CON OP2197: C118#2 C120#2 R92#2 R93#2 R94#2 R95#2 R96#2 R97#2 R98#2 R99#2 TP64#2 TP65#2 TP66#2 TP67#2 U8
CAPACITORES DE BYPASS: C121#2 C122#2 C123#2 C124#2

### Ports
REFIO_CH1 (out), REFIO_CH2 (out), SPI_CLK (in), SPI_CS_DAC8562 (in), SPI_MOSI (in)

### Nets
+A5V: B12.9(AVDD) C121#2.2 C122#2.2 C123#2.2 C124#2.2 U8.8(V+)
GND: B12.3(GND) B12.4(~{LDAC}) B12.5(~{CLR}) C118#2.1 C119#2.2 C120#2.1 C121#2.1 C122#2.1 C123#2.1 C124#2.1 R95#2.1 R99#2.1 U8.4(V-)
DAC8562_VOUTA: B12.1(VOUTA) R92#2.2 TP64#2.1(TP)
DAC8562_VOUTB: B12.2(VOUTB) R96#2.2 TP66#2.1(TP)
MCU_GPIO26: B12.6(~{SYNC}) ; port SPI_CS_DAC8562
REFIO_CH1: R94#2.2 ; port REFIO_CH1  [project net DDS_REFIO_CH1]
REFIO_CH2: R98#2.2 ; port REFIO_CH2  [project net DDS_REFIO_CH2]
SPI_CLK: B12.7(SCLK) ; port SPI_CLK
SPI_MOSI: B12.8(DIN) ; port SPI_MOSI
NetB12_10: B12.10(VREFIN/VREFOUT) C119#2.1
NetC118#2_2: C118#2.2 R93#2.2 U8.3(+IN_A)
NetC120#2_2: C120#2.2 R97#2.2 U8.5(+IN_B)
NetR92#2_1: R92#2.1 R93#2.1 R95#2.2 TP65#2.1(TP)
NetR94#2_1: R94#2.1 U8.1(OUT_A) U8.2(-IN_A)
NetR96#2_1: R96#2.1 R97#2.1 R99#2.2 TP67#2.1(TP)
NetR98#2_1: R98#2.1 U8.6(-IN_B) U8.7(OUT_B)

### Notes on the sheet
- Se aplica un divisor resistivo de 2.
  Vout = 0 a 1.25V
- Utiliza la referencia interna de 2.5V.
- Vout = 0 a 5V
- Filtrado de fc ~ 35Hz
- de
- (in symbol CMP-04895-000044-1, part A) +; -
- (in symbol CMP-04895-000044-1, part B) +; -

### Library data of the parts
B12 = DAC8562SDGSR: 16-bit, dual-channel, low-power, ultra-low glitch, voltage output DAC with 2.5V, 4ppm/C reference; Manufacturer_Name: Texas Instruments; Geometry.Height: 1.1mm; Mouser Part Number: 595-DAC8562SDGSR; Mouser Price/Stock: https://www.mouser.co.uk/ProductDetail/Texas-Instruments/DAC8562SDGSR?qs=L4ss%2FyqpMWQjhHzbOFnTNg%3D%3D; Manufacturer_Part_Number: DAC8562SDGSR; Datasheet Link: http://www.ti.com/lit/gpn/dac8562
C118#2 C119#2 C120#2 C121#2 C122#2 C123#2 C124#2 = CAP_0805: Capacitor SMD 0805; Manufacturer: *; Manufacturer Part Number: *; Distributor Link: *; LCSC: *; Rating: *; Dielectric: *
R92#2 R93#2 R94#2 R95#2 R96#2 R97#2 R98#2 R99#2 = RES_0805: Resistor SMD 0805; Manufacturer: *; Manufacturer Part Number: *; Distributor Link: *; LCSC: *
TP64#2 TP65#2 TP66#2 TP67#2 = TEST_POINT_RND_1MM: Test Point Round 1mm (NO BOM)
U8 = CMP-04895-000044-1: IC OP AMP GP RR 10MHZ 8-SOIC; Manufacturer: Texas Instruments; Output Current Per Channel: 65mA; Min Supply Voltage: 4.5V; Input Offset Voltage: 0.025mV; Number Of Channels: 2; Voltage Gain: 134-143dB; Max Dual Supply Voltage: 18V; Min Dual Supply Voltage: 2.25V; Standoff Height: 0.11mm; Max Supply Voltage: 36V; Input Bias Current: 0.000005uA; Nominal Supply Current: 1mA; Max Junction Temp: +150°C; Temperature Range Low: -40°C; Package: D0008A; Temperature: -40°C to +125°C; Gain Bandwidth: 10MHz; Category: IC; Digikey Description: IC OP AMP GP RR 10MHZ 8-SOIC; Automotive: No; Height: 1.75mm; Ambient Temperature Range Low: -40°C; Device Class L3: Amplifiers - Op Amps; ComponentLink2URL: http://www.ti.com/lit/ds/symlink/opa2197.pdf; Lead Free: Yes; RoHS: TRUE; Manufacturer Part Number: OPA2197IDR; Device Class L1: Integrated Circuits (ICs); ComponentLink2Description: Datasheet; Ipc Land Pattern Name: SOIC127P600X175-8; Device Class L2: Linear ICs; Temperature Range High: +125°C; Octopart: https://octopart.com/opa2197idr-texas+instruments-75179702; Ambient Temperature Range High: +125°C

## Sheet MemoriaEEPROM.V03.R00.SchDoc: Memoria EEPROM
size A4; SheetNumber: 17; SheetTotal: 18
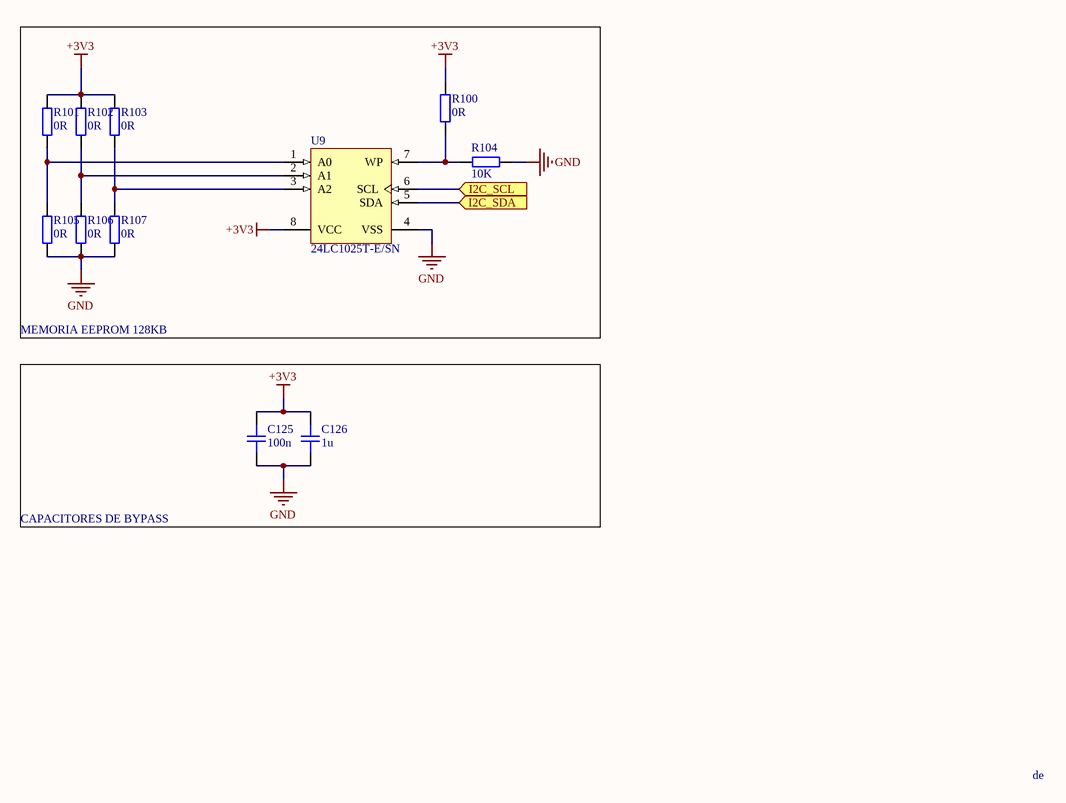
[diagram p16: MemoriaEEPROM.V03.R00.SchDoc]

### Parts
(Parts that share a designator on the sheet are numbered #1, #2 ... from top to bottom, then left to right.)
C125#2  100n  [CAP_0805]
C126#2  1u  [CAP_0805]
R100#2  0R  [RES_0805]
R101#2  0R  [RES_0805]
R102#2  0R  [RES_0805]
R103#2  0R  [RES_0805]
R104#2  10K  [RES_0805]
R105#2  0R  [RES_0805]
R106#2  0R  [RES_0805]
R107#2  0R  [RES_0805]
U9  24LC1025T-E/SN  [SOIC-SN8_M]

### Blocks framed on the sheet
MEMORIA EEPROM 128KB: R100#2 R101#2 R102#2 R103#2 R104#2 R105#2 R106#2 R107#2 U9
CAPACITORES DE BYPASS: C125#2 C126#2

### Ports
I2C_SCL (in), I2C_SDA (in)

### Nets
+3V3: C125#2.2 C126#2.2 R100#2.2 R101#2.2 R102#2.2 R103#2.2 U9.8(VCC)
GND: C125#2.1 C126#2.1 R104#2.2 R105#2.1 R106#2.1 R107#2.1 U9.4(VSS)
I2C_SCL: U9.6(SCL) ; port I2C_SCL
I2C_SDA: U9.5(SDA) ; port I2C_SDA
NetR100#2_1: R100#2.1 R104#2.1 U9.7(WP)
NetR101#2_1: R101#2.1 R105#2.2 U9.1(A0)
NetR102#2_1: R102#2.1 R106#2.2 U9.2(A1)
NetR103#2_1: R103#2.1 R107#2.2 U9.3(A2)

### Notes on the sheet
- de

### Library data of the parts
C125#2 C126#2 = CAP_0805: Capacitor SMD 0805; Manufacturer: *; Manufacturer Part Number: *; Distributor Link: *; LCSC: *; Rating: *; Dielectric: *
R100#2 R101#2 R102#2 R103#2 R104#2 R105#2 R106#2 R107#2 = RES_0805: Resistor SMD 0805; Manufacturer: *; Manufacturer Part Number: *; Distributor Link: *; LCSC: *
U9 = CMP-0159-00340-1: 1 Mbit, 400kHz, 2.5V, 8-Pin SOIC 150mil, Extended Temperature, Tape and Reel; Code_JEDEC: MS-012; PackageVersion: revBB, Aug-2009; PackageDescription: 8-Lead Plastic Small Outline (SN) - Narrow, 3.90mm Body [SOIC]; DatasheetVersion: revF, Oct-2008; PackageReference: SOIC-SN8; Code_IPC: SOIC127P600-8

## Sheet Ethernet.V03.R00.SchDoc: Comunicación Ethernet
size A4; SheetNumber: 18; SheetTotal: 18
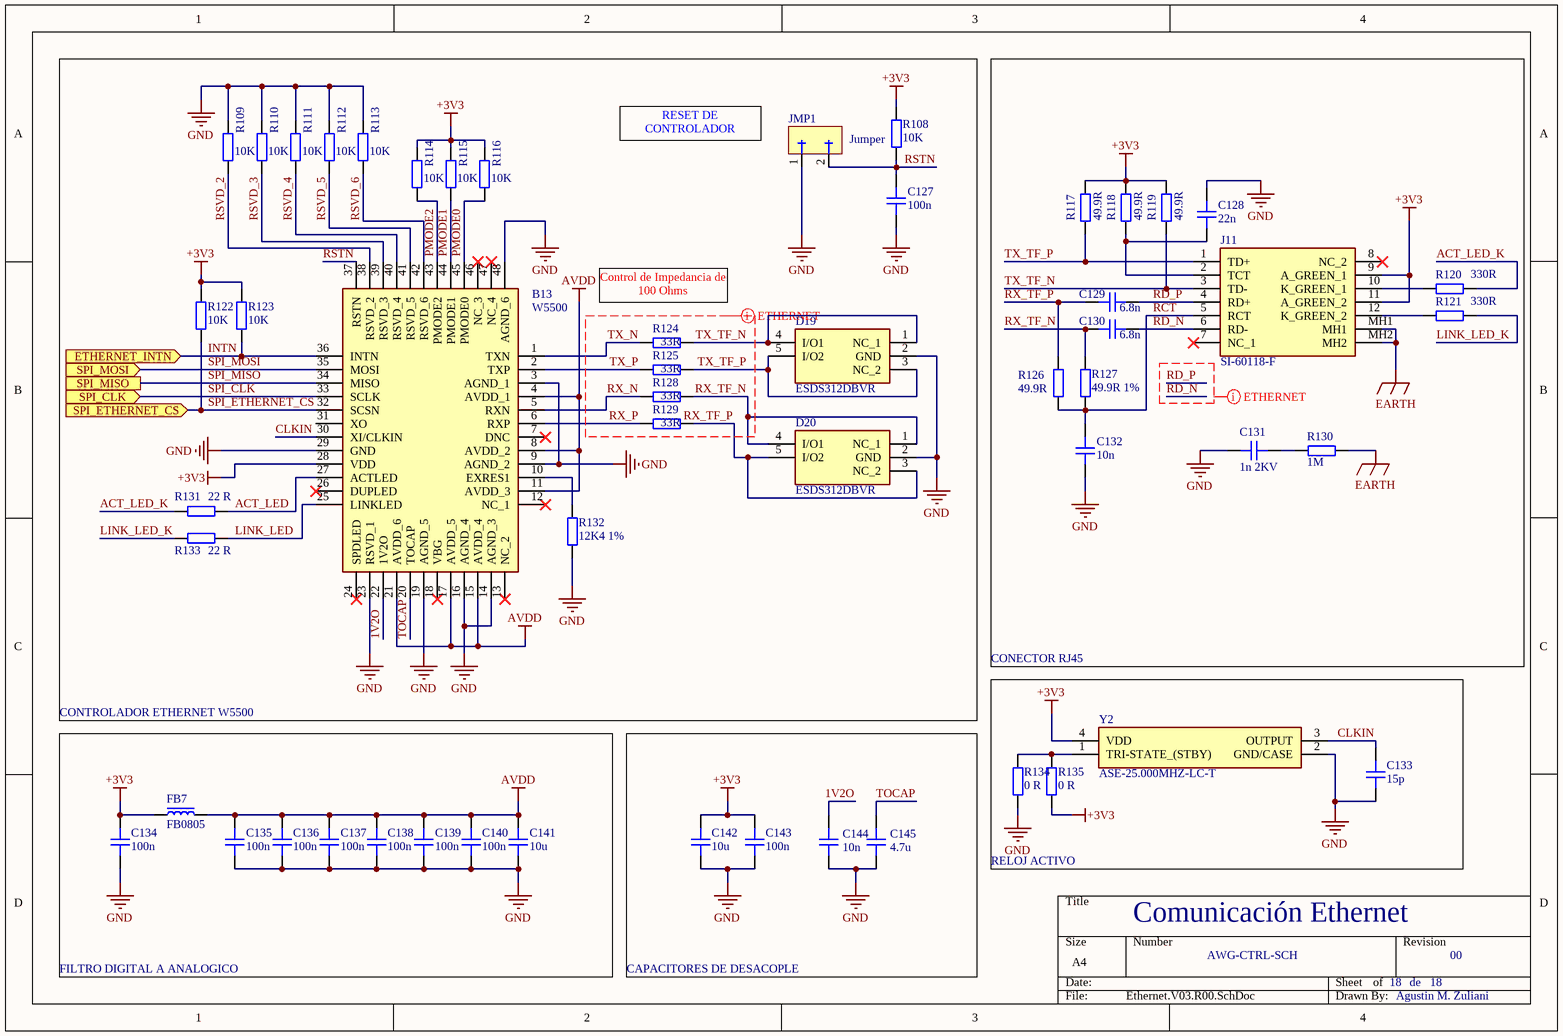
[diagram p17: Ethernet.V03.R00.SchDoc]

### Parts
(Parts that share a designator on the sheet are numbered #1, #2 ... from top to bottom, then left to right.)
B13#2  W5500  [QFP50P900X900X160-48N]
C127#2  100n  [CAP_0805]
C128#2  22n  [CAP_0805]
C129#2  6.8n  [CAP_0805]
C130#2  6.8n  [CAP_0805]
C131#2  1n 2KV  [CAP_0805]
C132#2  10n  [CAP_0805]
C133#2  15p  [CAP_0805]
C134#2  100n  [CAP_0805]
C135#2  100n  [CAP_0805]
C136#2  100n  [CAP_0805]
C137  100n  [CAP_0805]
C138  100n  [CAP_0805]
C139#2  100n  [CAP_0805]
C140#2  100n  [CAP_0805]
C141#2  10u  [CAP_0805]
C142#2  10u  [CAP_0805]
C143#2  100n  [CAP_0805]
C144#2  10n  [CAP_0805]
C145#2  4.7u  [CAP_0805]
D19  ESDS312DBVR  [SOT95P280X145-5N]
D20  ESDS312DBVR  [SOT95P280X145-5N]
FB7  FB0805  [FB_0805]
J11  SI-60118-F  [SI60118F]
JMP1  Jumper  [JMP2_TH]
R108#2  10K  [RES_0805]
R109#2  10K  [RES_0805]
R110#2  10K  [RES_0805]
R111#2  10K  [RES_0805]
R112#2  10K  [RES_0805]
R113#2  10K  [RES_0805]
R114  10K  [RES_0805]
R115  10K  [RES_0805]
R116  10K  [RES_0805]
R117  49.9R  [RES_0805]
R118  49.9R  [RES_0805]
R119  49.9R  [RES_0805]
R120  330R  [RES_0805]
R121  330R  [RES_0805]
R122  10K  [RES_0805]
R123  10K  [RES_0805]
R124  33R  [RES_0805]
R125  33R  [RES_0805]
R126  49.9R  [RES_0805]
R127  49.9R 1%  [RES_0805]
R128  33R  [RES_0805]
R129  33R  [RES_0805]
R130  1M  [RES_0805]
R131  22 R  [RES_0805]
R132  12K4 1%  [RES_0805]
R133  22 R  [RES_0805]
R134  0 R  [RES_0805]
R135  0 R  [RES_0805]
Y2  ASE-25.000MHZ-LC-T  [ASE24576MHZLCT]

### Blocks framed on the sheet
CONTROLADOR ETHERNET W5500: B13#2 C127#2 D19 D20 JMP1 R108#2 R109#2 R110#2 R111#2 R112#2 R113#2 R114-R116 R122-R125 R128 R129 R131-R133
CONECTOR RJ45: C128#2 C129#2 C130#2 C131#2 C132#2 J11 R117-R121 R126 R127 R130
CAPACITORES DE DESACOPLE: C142#2 C143#2 C144#2 C145#2

### Ports
ETHERNET_INTN (in), SPI_CLK (in), SPI_ETHERNET_CS (in), SPI_MISO, SPI_MOSI (in)

### Nets
+3V3: B13#2.28(VDD) C134#2.2 C142#2.2 C143#2.2 FB7.1 J11.9(A_GREEN_1) J11.11(A_GREEN_2) R108#2.1 R114.1 R115.2 R116.2 R117.2 R118.2 R119.2 R122.1 R123.1 R135.1 Y2.4(VDD)
AVDD: B13#2.4(AVDD_1) B13#2.8(AVDD_2) B13#2.11(AVDD_3) B13#2.15(AVDD_4) B13#2.17(AVDD_5) B13#2.21(AVDD_6) C135#2.2 C136#2.2 C137.2 C138.2 C139#2.2 C140#2.2 C141#2.2 FB7.2
EARTH: J11.MH1 J11.MH2 R130.2
GND: B13#2.3(AGND_1) B13#2.9(AGND_2) B13#2.14(AGND_3) B13#2.16(AGND_4) B13#2.19(AGND_5) B13#2.23(RSVD_1) B13#2.29(GND) B13#2.48(AGND_6) C127#2.1 C128#2.2 C131#2.1 C132#2.1 C133#2.1 C134#2.1 C135#2.1 C136#2.1 C137.1 C138.1 C139#2.1 C140#2.1 C141#2.1 C142#2.1 C143#2.1 C144#2.1 C145#2.1 D19.2(GND) D20.2(GND) JMP1.1 R109#2.1 R110#2.1 R111#2.1 R112#2.1 R113#2.1 R132.1 R134.1 Y2.2(GND/CASE)
1V2O: B13#2.22(1V2O) C144#2.2
ACT_LED: B13#2.27(ACTLED) R131.2
ACT_LED_K: R120.2 R131.1
CLKIN: B13#2.30(XI/CLKIN) C133#2.2 Y2.3(OUTPUT)
INTN: B13#2.36(INTN) R123.2 ; port ETHERNET_INTN  [project net ETH_INTN]
LINK_LED: B13#2.25(LINKLED) R133.2
LINK_LED_K: R121.2 R133.1
PMODE0: B13#2.45(PMODE0) R116.1
PMODE1: B13#2.44(PMODE1) R115.1
PMODE2: B13#2.43(PMODE2) R114.2
RCT: C132#2.2 J11.5(RCT) R126.1 R127.1
RD_N: C130#2.2 J11.6(RD-)
RD_P: C129#2.2 J11.4(RD+)
RSTN: B13#2.37(RSTN) C127#2.2 JMP1.2 R108#2.2
RSVD_2: B13#2.38(RSVD_2) R109#2.2
RSVD_3: B13#2.39(RSVD_3) R110#2.2
RSVD_4: B13#2.40(RSVD_4) R111#2.2
RSVD_5: B13#2.41(RSVD_5) R112#2.2
RSVD_6: B13#2.42(RSVD_6) R113#2.2
RX_N: B13#2.5(RXN) R128.2
RX_P: B13#2.6(RXP) R129.2
RX_TF_N: C130#2.1 D20.1(NC_1) D20.4(I/O1) R127.2 R128.1
RX_TF_P: C129#2.1 D20.3(NC_2) D20.5(I/O2) R126.2 R129.1
SPI_CLK: B13#2.33(SCLK) ; port SPI_CLK
SPI_ETHERNET_CS: B13#2.32(SCSN) R122.2 ; port SPI_ETHERNET_CS  [project net MCU_GPIO29]
SPI_MISO: B13#2.34(MISO) ; port SPI_MISO
SPI_MOSI: B13#2.35(MOSI) ; port SPI_MOSI
TOCAP: B13#2.20(TOCAP) C145#2.2
TX_N: B13#2.1(TXN) R124.2
TX_P: B13#2.2(TXP) R125.2
TX_TF_N: D19.1(NC_1) D19.4(I/O1) J11.3(TD-) R119.1 R124.1
TX_TF_P: D19.3(NC_2) D19.5(I/O2) J11.1(TD+) R117.1 R125.1
NetB13#2_10: B13#2.10(EXRES1) R132.2
NetC128#2_1: C128#2.1 J11.2(TCT) R118.1
NetC131#2_2: C131#2.2 R130.1
NetJ11_10: J11.10(K_GREEN_1) R120.1
NetJ11_12: J11.12(K_GREEN_2) R121.1
NetR134_2: R134.2 R135.2 Y2.1(TRI-STATE_(STBY))

Not connected (* = marked no-connect by the designer): B13#2 7(DNC)* 12(NC_1)* 13(NC_2)* 18(VBG)* 24(SPDLED)* 26(DUPLED)* 31(XO) 46(NC_3)* 47(NC_4)*; J11 7(NC_1)* 8(NC_2)*

### Layout directives
differential pair; differential pair class ETHERNET; rule Differential Pairs Routing [Pref Gap = 0.325mm    Min Gap  = 0.127mm    Max Gap  = 0.325mmPref Width = 0.13mm    Min Width  = 0.13mm    Max Width  = 0.13mm]; rule Matched Net Lengths [Tolerance = 1mm]; net class ETHERNET: RD_N, RD_P, RX_N, RX_P, RX_TF_N, RX_TF_P, TX_N, TX_P, TX_TF_N, TX_TF_P

### Notes on the sheet
- (near JMP1) RESET DE CONTROLADOR
- (near R124) Control de Impedancia de 100 Ohms
- RELOJ ACTIVO
- FILTRO DIGITAL A ANALOGICO
- de

### Library data of the parts
B13#2 = W5500: Ethernet ICs 3in1 Enet Controller TCP/IP +MAC+PHY; Manufacturer_Name: WIZnet Inc; Geometry.Height: 1.6mm; Mouser Part Number: 950-W5500; Mouser Price/Stock: https://www.mouser.co.uk/ProductDetail/WIZnet/W5500?qs=2vh%252B45pPFtzthUpYPd4pqA%3D%3D; Manufacturer_Part_Number: W5500; Datasheet Link: http://wizwiki.net/wiki/lib/exe/fetch.php?media=products:w5500:w5500_ds_v106e_141230.pdf
C127#2 C128#2 C129#2 C130#2 C131#2 C132#2 C133#2 C134#2 C135#2 C136#2 C137 C138 C139#2 C140#2 C141#2 C142#2 C143#2 C144#2 C145#2 = CAP_0805: Capacitor SMD 0805; Manufacturer: *; Manufacturer Part Number: *; Distributor Link: *; LCSC: *; Rating: *; Dielectric: *
D19 D20 = ESDS312DBVR: 3.6V Data-Line Surge and 30kV ESD Protection Diode Array; Manufacturer_Name: Texas Instruments; Geometry.Height: 1.45mm; Mouser Part Number: 595-ESDS312DBVR; Mouser Price/Stock: https://www.mouser.co.uk/ProductDetail/Texas-Instruments/ESDS312DBVR?qs=byeeYqUIh0PGNqB7QuJpTA%3D%3D; Manufacturer_Part_Number: ESDS312DBVR; Datasheet Link: http://www.ti.com/lit/gpn/esds312
FB7 = FB_0805: Ferrite Bead SMD 0805; Manufacturer: *; Manufacturer Part Number: *; Distributor Link: *; LCSC: *
J11 = SI-60118-F: MagJack 10/100BASE-T; Manufacturer_Name: BelFuse; Geometry.Height: 15.21mm; Mouser Part Number: 530-SI-60118-F; Mouser Price/Stock: https://www.mouser.com/Search/ProductDetail.aspx?qs=SRYZG9HaIQ1pVFtjOaj56g%3d%3d; Manufacturer_Part_Number: SI-60118-F; Datasheet Link: https://componentsearchengine.com/Datasheets/1/SI-60118-F.pdf
JMP1 = JMP2_TH: Jumper 2 Pins Through-Hole DO NOT PLACE
R108#2 R109#2 R110#2 R111#2 R112#2 R113#2 R114-R135 = RES_0805: Resistor SMD 0805; Manufacturer: *; Manufacturer Part Number: *; Distributor Link: *; LCSC: *
Y2 = ASE-25.000MHZ-LC-T: Crystal or Oscillator; Manufacturer_Name: ABRACON; Datasheet Link: https://abracon.com/Oscillators/ASEseries.pdf; Height: 1.2mm; Manufacturer_Part_Number: ASE-25.000MHZ-LC-T; Mouser Part Number: 815-ASE25.000MHZLCT; Mouser Price/Stock: https://www.mouser.co.uk/ProductDetail/ABRACON/ASE-25.000MHZ-LC-T?qs=ShQ8XZQtgRuW6p4KtHOZPQ%3D%3D; Arrow Part Number: ASE-25.000MHZ-LC-T; Arrow Price/Stock: https://www.arrow.com/en/products/ase-25.000mhz-lc-t/abracon?utm_currency=USD&region=nac